# Altium project RSX_High_Power_Board.PrjPcb (part 1 of 2)
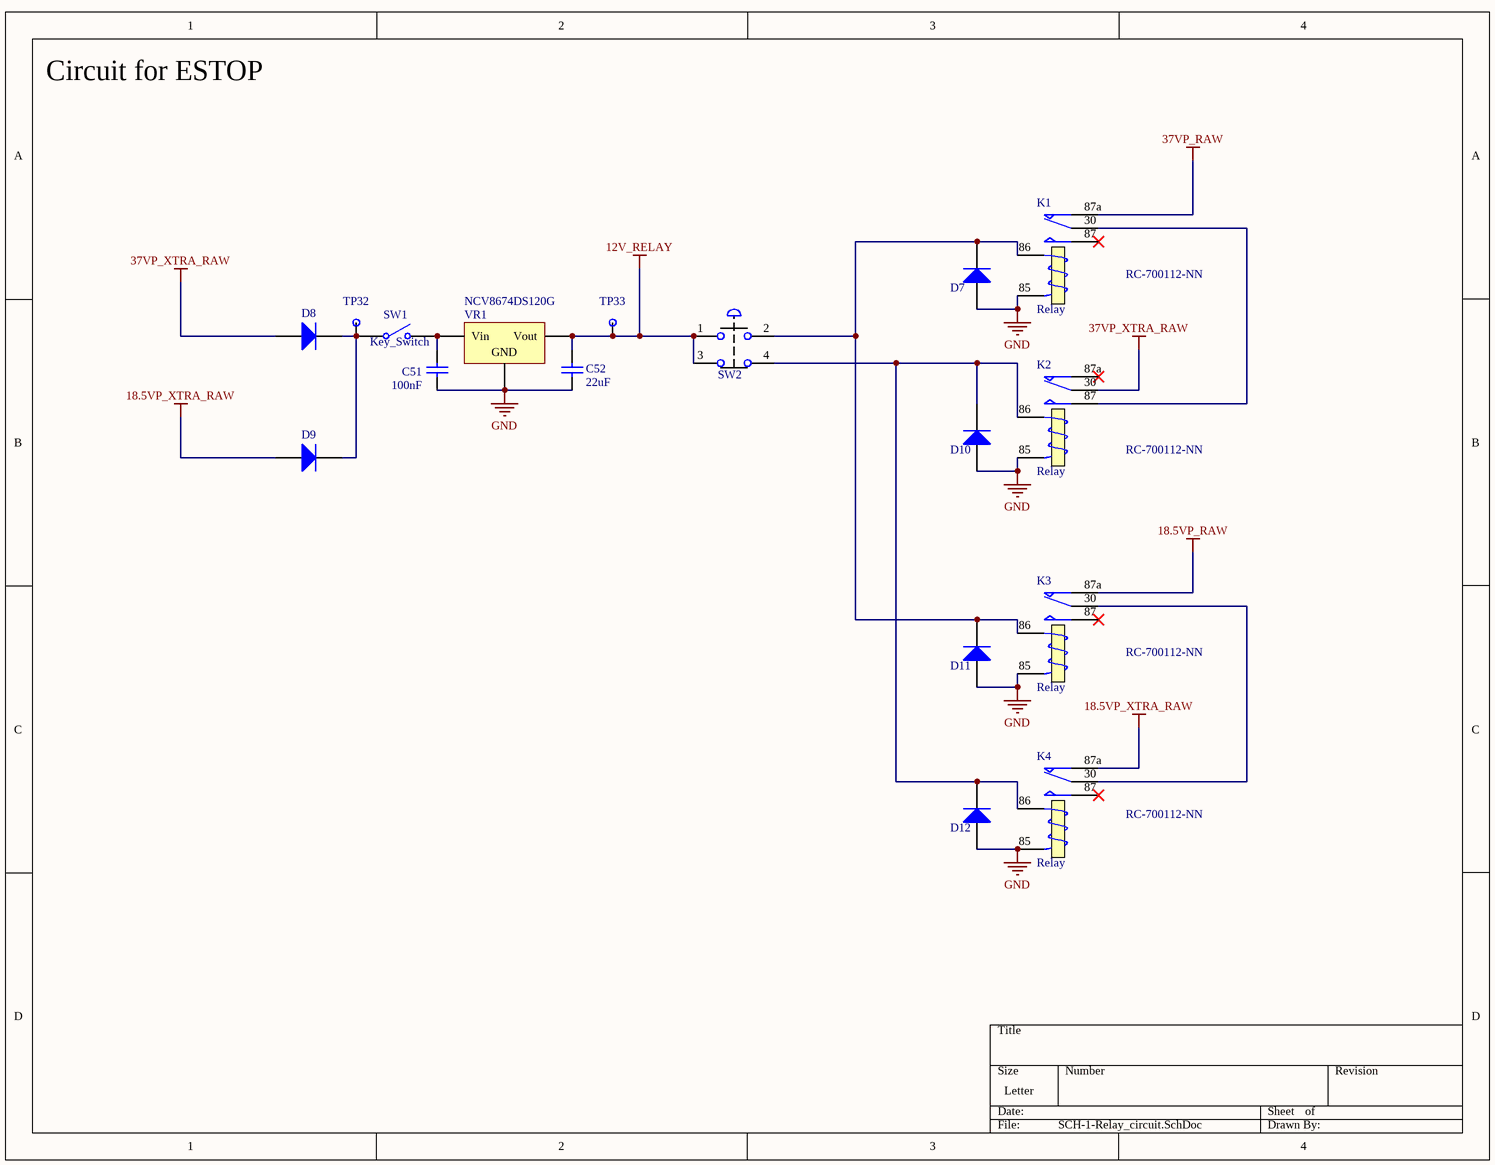
[diagram p0: SCH-1-Relay_circuit.SchDoc]
18 sheets, 301 parts. Net scope: flat (ports and power ports of the same name join across sheets).
Board file: High_Power_Board_v3.PcbDoc
Sheets:
  SCH-1-Relay_circuit.SchDoc
  SCH-2-Main Controls.SchDoc
  SCH-3-ESC1.SchDoc
  SCH-4-ESC2.SchDoc
  SCH-5-ESC3.SchDoc
  SCH-6-ESC4.SchDoc
  SCH-7-ESC5.SchDoc
  SCH-8-ESC6.SchDoc
  SCH-9-Battery Voltage Indicators.SchDoc
  SCH-10-Power Connectors.SchDoc
  SCH-11-Out Going Connectors.SchDoc
  3V3_board.SchDoc
  5V_board.SchDoc
  12V_board.SchDoc
  24V_board.SchDoc
  37V_efuse.SchDoc
  18V5_efuse.SchDoc
  Mounting_Holes.SchDoc

## Sheet SCH-1-Relay_circuit.SchDoc
size Letter

### Parts
C51  value 100nF  [1608[0603]]  (hidden comment: Cap)
C52  value 22uF  [1608[0603]]  (hidden comment: Cap)
D7  Diode 1N4001  [DO-41]  (value not drawn)
D8  Diode 1N4001  [DO-41]  (value not drawn)
D9  Diode 1N4001  [DO-41]  (value not drawn)
D10  Diode 1N4001  [DO-41]  (value not drawn)
D11  Diode 1N4001  [DO-41]  (value not drawn)
D12  Diode 1N4001  [DO-41]  (value not drawn)
K1  Relay  [Relay RC-700112-NN]
K2  Relay  [Relay RC-700112-NN]
K3  Relay  [Relay RC-700112-NN]
K4  Relay  [Relay RC-700112-NN]
SW1  Key_Switch  [MOLEX_0039293026]
SW2  NO-NC ESD with light  [MOLEX 0039281043]  (value not drawn)
TP32  TestPt  [50_MIL_PAD]  (value not drawn)
TP33  TestPt  [50_MIL_PAD]  (value not drawn)
VR1  Volt Reg  [DPAK254P1420X457-3N]  (value not drawn)

### Nets
12V_RELAY: C52.1 SW2.1 SW2.3 TP33.1 VR1.3(Vout)
18.5VP_RAW: K3.87a(NC)
18.5VP_XTRA_RAW: D9.1(A) K4.87a(NC)
37VP_RAW: K1.87a(NC)
37VP_XTRA_RAW: D8.1(A) K2.30(COM)
GND: C51.2 C52.2 D7.1(A) D10.1(A) D11.1(A) D12.1(A) K1.85(T2) K2.85(T2) K3.85(T2) K4.85(T2) VR1.2(GND)
NetC51_1: C51.1 SW1.2(NO) VR1.1(Vin)
NetD7_2: D7.2(K) D11.2(K) K1.86(T1) K3.86(T1) SW2.2
NetD8_2: D8.2(K) D9.2(K) SW1.1(COMMON) TP32.1
NetD10_2: D10.2(K) D12.2(K) K2.86(T1) K4.86(T1) SW2.4
NetK1_30: K1.30(COM) K2.87(NO)
NetK3_30: K3.30(COM) K4.30(COM)

Not connected (* = marked no-connect by the designer): K1 87(NO)*; K2 87a(NC)*; K3 87(NO)*; K4 87(NO)*

### Notes on the sheet
- Circuit for ESTOP
- (near VR1) NCV8674DS120G
- RC-700112-NN

### Library data of the parts
C51 C52 = Cap: Capacitor; Published: 8-Jun-2000; LatestRevisionDate: 17-Jul-2002; LatestRevisionNote: Re-released for DXP Platform.; PackageReference: RAD-0.3; Publisher: Altium Limited; PackageDescription: Radial Cap, Thru-Hole; 2 Leads; 0.3 in Pin Spacing
D7-D12 = Diode 1N4001: 1 Amp General Purpose Rectifier; Published: 8-Jun-2000; LatestRevisionDate: 17-Jul-2002; LatestRevisionNote: Re-released for DXP Platform.; DatasheetVersion: 1998; PackageVersion: Aug-1999; PackageReference: DO-41; Publisher: Altium Limited; PackageDescription: Diode, Axial; Body 5.2 x 2.7 mm (LxDia. max), Lead Dia. 0.86 mm (max); Code_JEDEC: DO-204-AL; ComponentLink1Description: Manufacturer Link; ComponentLink1URL: http://www.fairchildsemi.com/; ComponentLink2Description: Datasheet; ComponentLink2URL: http://www.fairchildsemi.com/ds/1N%2F1N4001.pdf
K1-K4 = Relay: SPDT Relay; Published: 8-Jun-2000; LatestRevisionDate: 17-Jul-2002; LatestRevisionNote: Re-released for DXP Platform.; PackageReference: MODULE5B; Publisher: Altium Limited
SW2 = DPST ESTOP
VR1 = Volt Reg: Voltage Regulator; Published: 24-Mar-1999; LatestRevisionDate: 29-May-2009; LatestRevisionNote: IPC-7351 Footprint Added.; PackageReference: D2PAK; Publisher: Altium Limited; PackageDescription: 3-Pin Transistor Outline Package 2.54 mm Pitch, 15.1 mm Lead Span
SW1 = Key_Switch: Published: 24-Mar-1999; LatestRevisionDate: 17-Jul-2002; LatestRevisionNote: Re-released for DXP Platform.; PackageReference: SPST-2; Publisher: Altium Limited; PackageDescription: Switch; 2 Leads

## Sheet SCH-2-Main Controls.SchDoc
size Letter
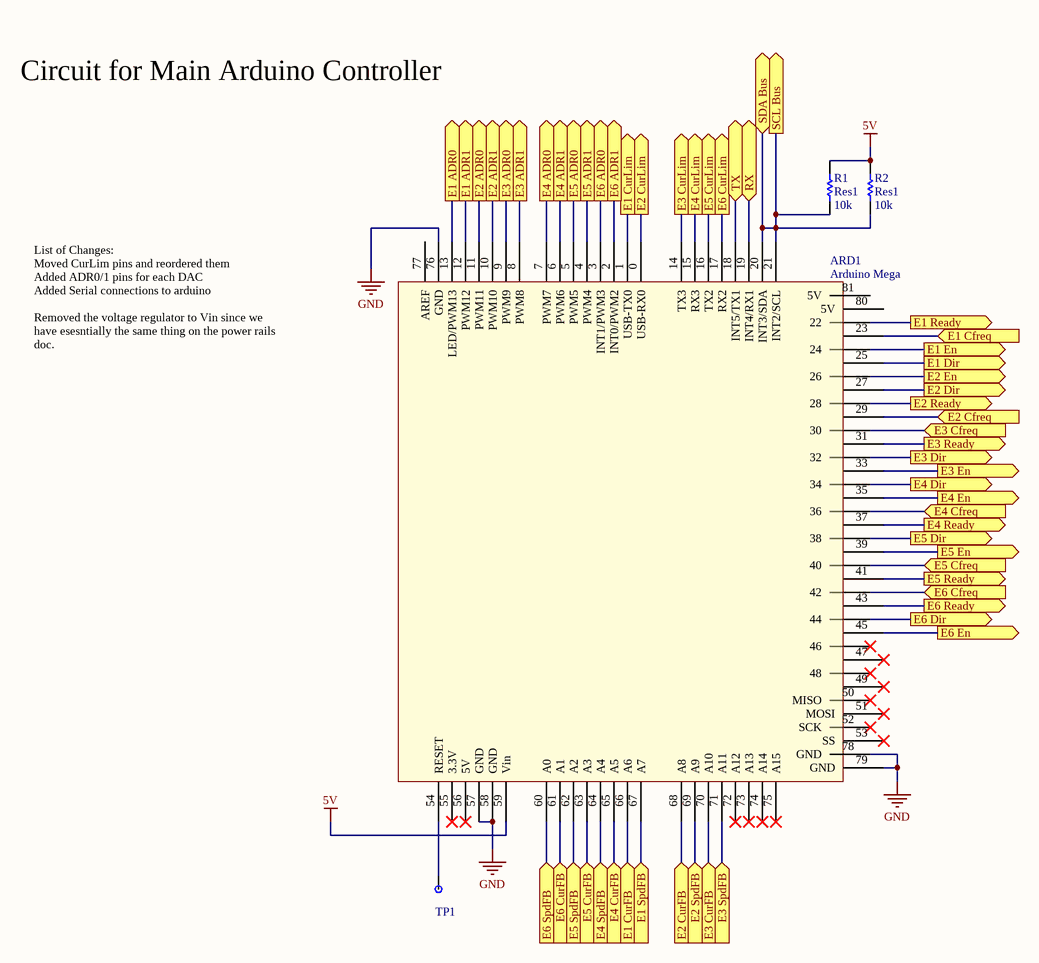
[diagram p1: SCH-2-Main Controls.SchDoc]

### Parts
ARD1  Arduino Mega  [Arduino Mega]
R1  Res1  value 10k  [RESC1608X06N_0603]
R2  Res1  value 10k  [RESC1608X06N_0603]
TP1  TestPt  [50_MIL_PAD]  (value not drawn)

### Ports
E1 ADR0 (out), E1 ADR1 (out), E1 Cfreq (in), E1 CurFB (in), E1 CurLim (out), E1 Dir (out), E1 En (out), E1 Ready (out), E1 SpdFB (in), E2 ADR0 (out), E2 ADR1 (out), E2 Cfreq (in), E2 CurFB (in), E2 CurLim (out), E2 Dir (out), E2 En (out), E2 Ready (out), E2 SpdFB (in), E3 ADR0 (out), E3 ADR1 (out), E3 Cfreq (in), E3 CurFB (in), E3 CurLim (out), E3 Dir (out), E3 En (out), E3 Ready (out), E3 SpdFB (in), E4 ADR0 (out), E4 ADR1 (out), E4 Cfreq (in), E4 CurFB (in), E4 CurLim (out), E4 Dir (out), E4 En (out), E4 Ready (out), E4 SpdFB (in), E5 ADR0 (out), E5 ADR1 (out), E5 Cfreq (in), E5 CurFB (in), E5 CurLim (out), E5 Dir (out), E5 En (out), E5 Ready (out), E5 SpdFB (in), E6 ADR0 (out), E6 ADR1 (out), E6 Cfreq (in), E6 CurFB (in), E6 CurLim (out), E6 Dir (out), E6 En (out), E6 Ready (out), E6 SpdFB (in), RX (bidir), SCL Bus (out), SDA Bus (bidir), TX (bidir)

### Nets
5V: ARD1.59(Vin) R1.2 R2.2
GND: ARD1.57(GND) ARD1.58(GND) ARD1.76(GND) ARD1.78(GND) ARD1.79(GND)
NetARD1_0: ARD1.0(USB-RX0) ; port E2 CurLim
NetARD1_1: ARD1.1(USB-TX0) ; port E1 CurLim
NetARD1_2: ARD1.2(INT0/PWM2) ; port E6 ADR1
NetARD1_3: ARD1.3(INT1/PWM3) ; port E6 ADR0
NetARD1_4: ARD1.4(PWM4) ; port E5 ADR1
NetARD1_5: ARD1.5(PWM5) ; port E5 ADR0
NetARD1_6: ARD1.6(PWM6) ; port E4 ADR1
NetARD1_7: ARD1.7(PWM7) ; port E4 ADR0
NetARD1_8: ARD1.8(PWM8) ; port E3 ADR1
NetARD1_9: ARD1.9(PWM9) ; port E3 ADR0
NetARD1_10: ARD1.10(PWM10) ; port E2 ADR1
NetARD1_11: ARD1.11(PWM11) ; port E2 ADR0
NetARD1_12: ARD1.12(PWM12) ; port E1 ADR1
NetARD1_13: ARD1.13(LED/PWM13) ; port E1 ADR0
NetARD1_14: ARD1.14(TX3) ; port E3 CurLim
NetARD1_15: ARD1.15(RX3) ; port E4 CurLim
NetARD1_16: ARD1.16(TX2) ; port E5 CurLim
NetARD1_17: ARD1.17(RX2) ; port E6 CurLim
NetARD1_18: ARD1.18(INT5/TX1) ; port TX
NetARD1_19: ARD1.19(INT4/RX1) ; port RX
NetARD1_20: ARD1.20(INT3/SDA) ARD1.21(INT2/SCL) R1.1 R2.1 ; port SCL Bus, port SDA Bus
NetARD1_22: ARD1.22 ; port E1 Ready
NetARD1_23: ARD1.23 ; port E1 Cfreq
NetARD1_24: ARD1.24 ; port E1 En
NetARD1_25: ARD1.25 ; port E1 Dir
NetARD1_26: ARD1.26 ; port E2 En
NetARD1_27: ARD1.27 ; port E2 Dir
NetARD1_28: ARD1.28 ; port E2 Ready
NetARD1_29: ARD1.29 ; port E2 Cfreq
NetARD1_30: ARD1.30 ; port E3 Cfreq
NetARD1_31: ARD1.31 ; port E3 Ready
NetARD1_32: ARD1.32 ; port E3 Dir
NetARD1_33: ARD1.33 ; port E3 En
NetARD1_34: ARD1.34 ; port E4 Dir
NetARD1_35: ARD1.35 ; port E4 En
NetARD1_36: ARD1.36 ; port E4 Cfreq
NetARD1_37: ARD1.37 ; port E4 Ready
NetARD1_38: ARD1.38 ; port E5 Dir
NetARD1_39: ARD1.39 ; port E5 En
NetARD1_40: ARD1.40 ; port E5 Cfreq
NetARD1_41: ARD1.41 ; port E5 Ready
NetARD1_42: ARD1.42 ; port E6 Cfreq
NetARD1_43: ARD1.43 ; port E6 Ready
NetARD1_44: ARD1.44 ; port E6 Dir
NetARD1_45: ARD1.45 ; port E6 En
NetARD1_54: ARD1.54(RESET) TP1.1
NetARD1_60: ARD1.60(A0) ; port E6 SpdFB
NetARD1_61: ARD1.61(A1) ; port E6 CurFB
NetARD1_62: ARD1.62(A2) ; port E5 SpdFB
NetARD1_63: ARD1.63(A3) ; port E5 CurFB
NetARD1_64: ARD1.64(A4) ; port E4 SpdFB
NetARD1_65: ARD1.65(A5) ; port E4 CurFB
NetARD1_66: ARD1.66(A6) ; port E1 CurFB
NetARD1_67: ARD1.67(A7) ; port E1 SpdFB
NetARD1_68: ARD1.68(A8) ; port E2 CurFB
NetARD1_69: ARD1.69(A9) ; port E2 SpdFB
NetARD1_70: ARD1.70(A10) ; port E3 CurFB
NetARD1_71: ARD1.71(A11) ; port E3 SpdFB

Not connected (* = marked no-connect by the designer): ARD1 46* 47* 48* 49* 50(MISO)* 51(MOSI)* 52(SCK)* 53(SS)* 55(3.3V)* 56(5V)* 72(A12)* 73(A13)* 74(A14)* 75(A15)* 77(AREF) 80(5V) 81(5V)

### Notes on the sheet
- Circuit for Main Arduino Controller
- List of Changes:
  Moved CurLim pins and reordered them
  Added ADR0/1 pins for each DAC
  Added Serial connections to arduino
  Removed the voltage regulator to Vin since we have esesntially the same thing on the power rails doc.

### Library data of the parts
R1 R2 = Res1: Resistor; Published: 8-Jun-2000; LatestRevisionDate: 17-Jul-2002; LatestRevisionNote: Re-released for DXP Platform.; PackageReference: AXIAL-0.3; Publisher: Altium Limited; PackageDescription: Axial Device, Thru-Hole; 2 Leads; 0.3 in Pin Spacing

## Sheet SCH-3-ESC1.SchDoc
size Letter; SheetNumber: 2
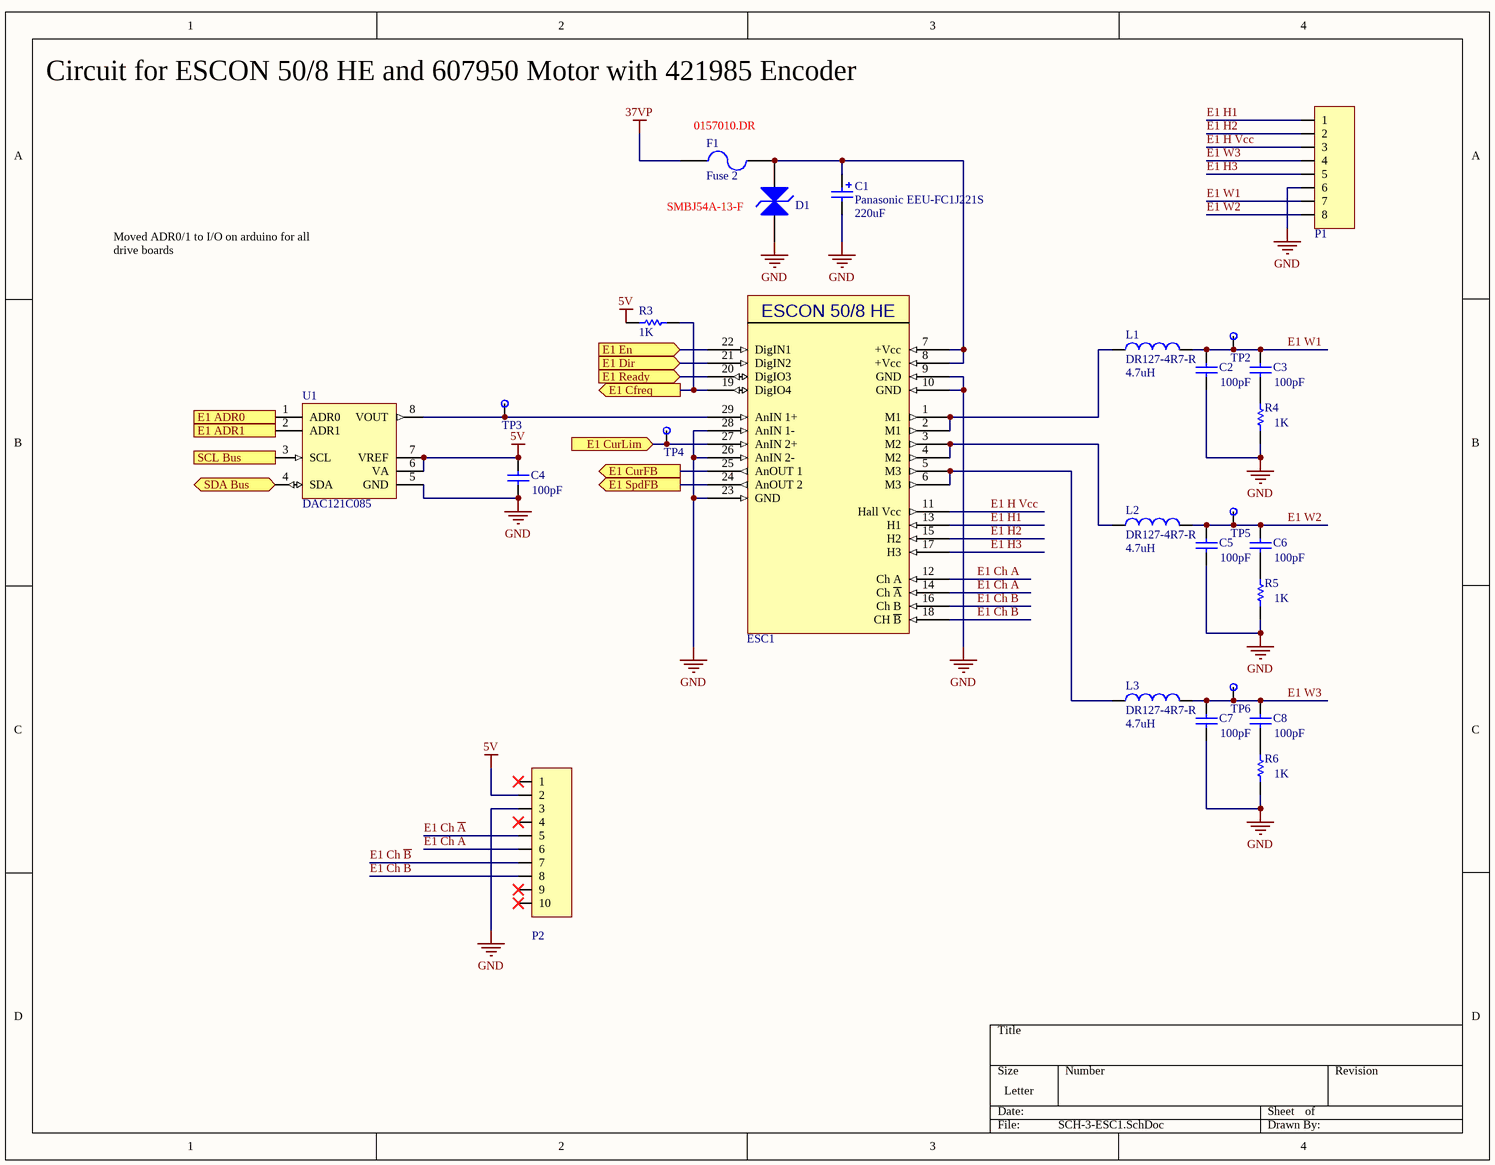
[diagram p2: SCH-3-ESC1.SchDoc]

### Parts
C1  Panasonic EEU-FC1J221S  value 220uF  [Panasonic EEU-FC1J221S]
C2  value 100pF  [C1206]  (hidden comment: Cap Semi)
C3  value 100pF  [C1206]  (hidden comment: Cap Semi)
C4  value 100pF  [C1206]  (hidden comment: Cap Semi)
C5  value 100pF  [C1206]  (hidden comment: Cap Semi)
C6  value 100pF  [C1206]  (hidden comment: Cap Semi)
C7  value 100pF  [C1206]  (hidden comment: Cap Semi)
C8  value 100pF  [C1206]  (hidden comment: Cap Semi)
D1  TVS_DIODE  [SMBJ54A-13-F]  (value not drawn)
ESC1  ESCON 50/8 HE  [ESCON 50/8 HE]  (value not drawn)
F1  Fuse 2  [0157010.DR]
L1  DR127-4R7-R  value 4.7uH  [DR127-4R7-R]
L2  DR127-4R7-R  value 4.7uH  [DR127-4R7-R]
L3  DR127-4R7-R  value 4.7uH  [DR127-4R7-R]
P1  0039281083  [Molex Mini-Fit Jr 0039281083]  (value not drawn)
P2  Header_10_Pos_Ribbon Male  [3M_2510-6002UB]  (value not drawn)
R3  value 1K  [RESC1608X06N_0603]  (hidden comment: Res1)
R4  value 1K  [RESC1608X06N_0603]  (hidden comment: Res1)
R5  value 1K  [RESC1608X06N_0603]  (hidden comment: Res1)
R6  value 1K  [RESC1608X06N_0603]  (hidden comment: Res1)
TP2  TestPt  [50_MIL_PAD]  (value not drawn)
TP3  TestPt  [50_MIL_PAD]  (value not drawn)
TP4  TestPt  [50_MIL_PAD]  (value not drawn)
TP5  TestPt  [50_MIL_PAD]  (value not drawn)
TP6  TestPt  [50_MIL_PAD]  (value not drawn)
U1  DAC121C085  [MUA08A_L]

### Ports
E1 ADR0 (in), E1 ADR1 (in), E1 Cfreq (out), E1 CurFB (out), E1 CurLim (in), E1 Dir (in), E1 En (in), E1 Ready (in), E1 SpdFB (out), SCL Bus (in), SDA Bus (bidir)

### Nets
5V: C4.2 P2.2 R3.2 U1.6(VA) U1.7(VREF)
37VP: F1.1
GND: C1.2 C2.1 C4.1 C5.1 C7.1 D1.1(A) ESC1.9(GND) ESC1.10(GND) ESC1.23(GND) ESC1.26(AnIN_2-) ESC1.28(AnIN_1-) P1.6 P2.3 R4.1 R5.1 R6.1 U1.5(GND)
E1 Ch A: ESC1.12(Ch_A) P2.6
E1 Ch ~{A}: ESC1.14(Ch_~{A}) P2.5
E1 Ch B: ESC1.16(Ch_B) P2.8
E1 Ch ~{B}: ESC1.18(CH_~{B}) P2.7
E1 H1: ESC1.13(H1) P1.1
E1 H2: ESC1.15(H2) P1.2
E1 H3: ESC1.17(H3) P1.5
E1 H Vcc: ESC1.11(Hall_Vcc) P1.3
E1 W1: C2.2 C3.2 L1.2 P1.7 TP2.1
E1 W2: C5.2 C6.2 L2.2 P1.8 TP5.1
E1 W3: C7.2 C8.2 L3.2 P1.4 TP6.1
NetARD1_1: ESC1.27(AnIN_2+) TP4.1 ; port E1 CurLim
NetARD1_12: U1.2(ADR1) ; port E1 ADR1
NetARD1_13: U1.1(ADR0) ; port E1 ADR0
NetARD1_20: U1.3(SCL) U1.4(SDA) ; port SCL Bus, port SDA Bus
NetARD1_22: ESC1.20(DigIO3) ; port E1 Ready
NetARD1_23: ESC1.19(DigIO4) R3.1 ; port E1 Cfreq
NetARD1_24: ESC1.22(DigIN1) ; port E1 En
NetARD1_25: ESC1.21(DigIN2) ; port E1 Dir
NetARD1_66: ESC1.25(AnOUT_1) ; port E1 CurFB
NetARD1_67: ESC1.24(AnOUT_2) ; port E1 SpdFB
NetC1_1: C1.1 D1.2(K) ESC1.7(+Vcc) ESC1.8(+Vcc) F1.2
NetC3_1: C3.1 R4.2
NetC6_1: C6.1 R5.2
NetC8_1: C8.1 R6.2
NetESC1_1: ESC1.1(M1) ESC1.2(M1) L1.1
NetESC1_3: ESC1.3(M2) ESC1.4(M2) L2.1
NetESC1_5: ESC1.5(M3) ESC1.6(M3) L3.1
NetESC1_29: ESC1.29(AnIN_1+) TP3.1 U1.8(VOUT)

Not connected (* = marked no-connect by the designer): P2 1* 4* 9* 10*

### Notes on the sheet
- Circuit for ESCON 50/8 HE and 607950 Motor with 421985 Encoder
- (near F1) 0157010.DR
- SMBJ54A-13-F
- Moved ADR0/1 to I/O on arduino for all drive boards

### Library data of the parts
C1 = Panasonic EEU-FC1J221S: Polarized Capacitor (Radial)
C2-C8 = Cap Semi: Capacitor (Semiconductor SIM Model); Published: 8-Jun-2000; LatestRevisionDate: 29-May-2009; LatestRevisionNote: IPC-7351 Footprint Added.; PackageReference: C1206; Publisher: Altium Limited; PackageDescription: Chip Capacitor
D1 = TVS_DIODE: TVS Diode; Published: 8-Jun-2000; LatestRevisionDate: 17-Jul-2002; LatestRevisionNote: Re-released for DXP Platform.; PackageVersion: Sep-1996; PackageReference: SMC; Publisher: Altium Limited; PackageDescription: DO-214-AB/SMC; 2 C-Bend Leads; Body 7.9 x 5.9 mm, inc. leads (LxW); Code_JEDEC: DO-214-AB
ESC1 = ESCON 50/8 HE: ESCON Module 50/8 HE Servocontroller
F1 = Fuse 2: Fuse; Published: 8-Jun-2000; LatestRevisionDate: 17-Jul-2002; LatestRevisionNote: Re-released for DXP Platform.; PackageReference: PIN-W2/E2.8; Publisher: Altium Limited; PackageDescription: Thru-Hole; 2 Leads
L1-L3 = DR127-4R7-R: 4.7µH Shielded Wirewound Inductor 8.25A 9.17mOhm Nonstandard; Code_IEC: 1005; Published: 8-Jun-2000; LatestRevisionDate: 29-May-2009; LatestRevisionNote: IPC-7351 Footprint Added.; PackageReference: 0402-A; Publisher: Altium Limited; PackageDescription: Chip Inductor; Code_JEITA: 0402
P1 = Molex Mini-Fit Jr 8pos Vert: Mini-Fit Jr, 8 pos 2 row
P2 = Header_10_Pos_Ribbon Male: IDC, 10 pos, Male
R3-R6 = Res1: Resistor; Published: 8-Jun-2000; LatestRevisionDate: 17-Jul-2002; LatestRevisionNote: Re-released for DXP Platform.; PackageReference: AXIAL-0.3; Publisher: Altium Limited; PackageDescription: Axial Device, Thru-Hole; 2 Leads; 0.3 in Pin Spacing
U1 = DAC121C085: 12-Bit Micro Power Digital-to-Analog Converter with an I2C-Compatible Interface and External Reference, 8-pin Mini SOIC, Pb-Free; Manufacturer: National Semiconductor; PackageTopMarking: XTT*X90C; PowerWise: Y; CompType: D/A Converter; ComponentLink3URL: http://www.national.com/packaging/folders/mua08a.html; ComponentLink2URL: http://www.national.com/pf/DA/DAC121C085.html; Code_JEDEC: MO-187-AA; ComponentLink1URL: http://www.national.com/ds/DA/DAC121C085.pdf; RoHS: Y; PackageVersion: revF, Apr-2008; PackageDescription: MINI SOIC, .118 x .118 x .034in, 8 Lead, .0256in Pitch; PackageReference: MUA08A; PinCount: 8; DatasheetVersion: Mar-2008; ComponentLink1Description: DAC121C085 Datasheet; ComponentLink2Description: DAC121C085 Web Page; ComponentLink3Description: MUA08A Package Page; RevisionNote: Component URLs added

## Sheet SCH-4-ESC2.SchDoc
size Letter; SheetNumber: 2
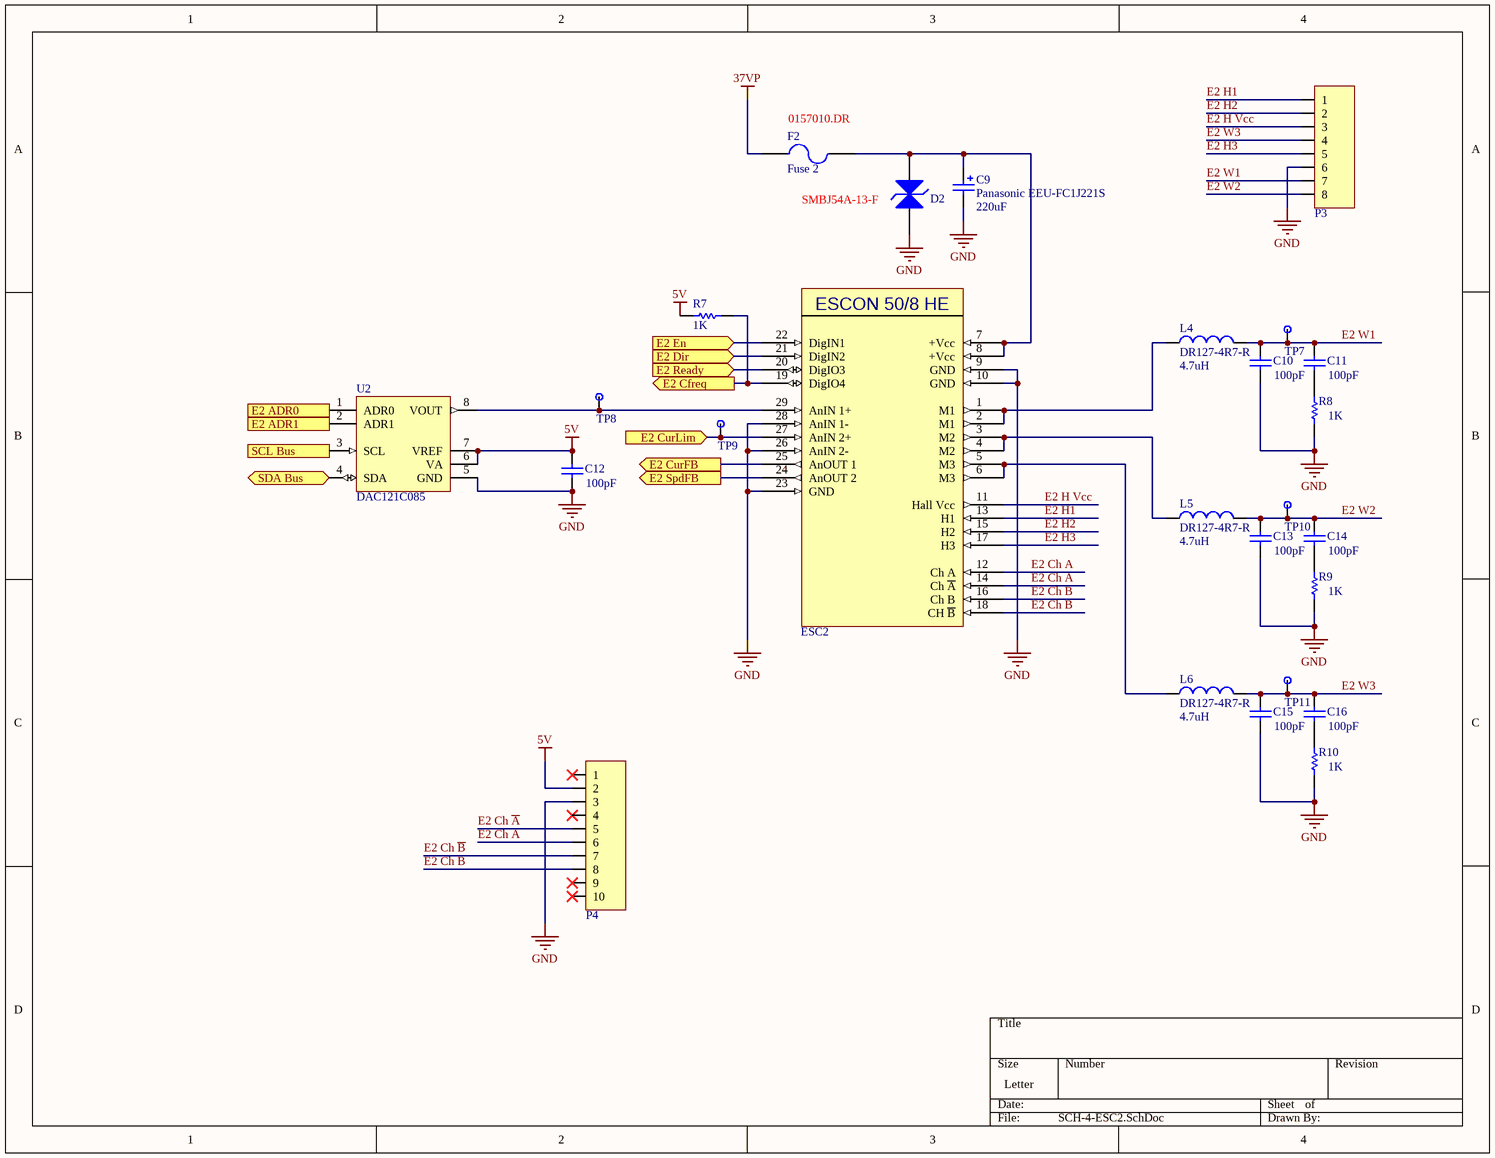
[diagram p3: SCH-4-ESC2.SchDoc]

### Parts
C9  Panasonic EEU-FC1J221S  value 220uF  [Panasonic EEU-FC1J221S]
C10  value 100pF  [C1206]  (hidden comment: Cap Semi)
C11  value 100pF  [C1206]  (hidden comment: Cap Semi)
C12  value 100pF  [C1206]  (hidden comment: Cap Semi)
C13  value 100pF  [C1206]  (hidden comment: Cap Semi)
C14  value 100pF  [C1206]  (hidden comment: Cap Semi)
C15  value 100pF  [C1206]  (hidden comment: Cap Semi)
C16  value 100pF  [C1206]  (hidden comment: Cap Semi)
D2  TVS_DIODE  [SMBJ54A-13-F]  (value not drawn)
ESC2  ESCON 50/8 HE  [ESCON 50/8 HE]  (value not drawn)
F2  Fuse 2  [0157010.DR]
L4  DR127-4R7-R  value 4.7uH  [DR127-4R7-R]
L5  DR127-4R7-R  value 4.7uH  [DR127-4R7-R]
L6  DR127-4R7-R  value 4.7uH  [DR127-4R7-R]
P3  0039281083  [Molex Mini-Fit Jr 0039281083]  (value not drawn)
P4  Header_10_Pos_Ribbon Male  [3M_2510-6002UB]  (value not drawn)
R7  value 1K  [RESC1608X06N_0603]  (hidden comment: Res1)
R8  value 1K  [RESC1608X06N_0603]  (hidden comment: Res1)
R9  value 1K  [RESC1608X06N_0603]  (hidden comment: Res1)
R10  value 1K  [RESC1608X06N_0603]  (hidden comment: Res1)
TP7  TestPt  [50_MIL_PAD]  (value not drawn)
TP8  TestPt  [50_MIL_PAD]  (value not drawn)
TP9  TestPt  [50_MIL_PAD]  (value not drawn)
TP10  TestPt  [50_MIL_PAD]  (value not drawn)
TP11  TestPt  [50_MIL_PAD]  (value not drawn)
U2  DAC121C085  [MUA08A_L]

### Ports
E2 ADR0 (in), E2 ADR1 (in), E2 Cfreq (out), E2 CurFB (out), E2 CurLim (in), E2 Dir (in), E2 En (in), E2 Ready (in), E2 SpdFB (out), SCL Bus (in), SDA Bus (bidir)

### Nets
5V: C12.2 P4.2 R7.2 U2.6(VA) U2.7(VREF)
37VP: F2.1
GND: C9.2 C10.1 C12.1 C13.1 C15.1 D2.1(A) ESC2.9(GND) ESC2.10(GND) ESC2.23(GND) ESC2.26(AnIN_2-) ESC2.28(AnIN_1-) P3.6 P4.3 R8.1 R9.1 R10.1 U2.5(GND)
E2 Ch A: ESC2.12(Ch_A) P4.6
E2 Ch ~{A}: ESC2.14(Ch_~{A}) P4.5
E2 Ch B: ESC2.16(Ch_B) P4.8
E2 Ch ~{B}: ESC2.18(CH_~{B}) P4.7
E2 H1: ESC2.13(H1) P3.1
E2 H2: ESC2.15(H2) P3.2
E2 H3: ESC2.17(H3) P3.5
E2 H Vcc: ESC2.11(Hall_Vcc) P3.3
E2 W1: C10.2 C11.2 L4.2 P3.7 TP7.1
E2 W2: C13.2 C14.2 L5.2 P3.8 TP10.1
E2 W3: C15.2 C16.2 L6.2 P3.4 TP11.1
NetARD1_0: ESC2.27(AnIN_2+) TP9.1 ; port E2 CurLim
NetARD1_10: U2.2(ADR1) ; port E2 ADR1
NetARD1_11: U2.1(ADR0) ; port E2 ADR0
NetARD1_20: U2.3(SCL) U2.4(SDA) ; port SCL Bus, port SDA Bus
NetARD1_26: ESC2.22(DigIN1) ; port E2 En
NetARD1_27: ESC2.21(DigIN2) ; port E2 Dir
NetARD1_28: ESC2.20(DigIO3) ; port E2 Ready
NetARD1_29: ESC2.19(DigIO4) R7.1 ; port E2 Cfreq
NetARD1_68: ESC2.25(AnOUT_1) ; port E2 CurFB
NetARD1_69: ESC2.24(AnOUT_2) ; port E2 SpdFB
NetC9_1: C9.1 D2.2(K) ESC2.7(+Vcc) ESC2.8(+Vcc) F2.2
NetC11_1: C11.1 R8.2
NetC14_1: C14.1 R9.2
NetC16_1: C16.1 R10.2
NetESC2_1: ESC2.1(M1) ESC2.2(M1) L4.1
NetESC2_3: ESC2.3(M2) ESC2.4(M2) L5.1
NetESC2_5: ESC2.5(M3) ESC2.6(M3) L6.1
NetESC2_29: ESC2.29(AnIN_1+) TP8.1 U2.8(VOUT)

Not connected (* = marked no-connect by the designer): P4 1* 4* 9* 10*

### Notes on the sheet
- (near F2) 0157010.DR
- SMBJ54A-13-F

### Library data of the parts
C9 = Panasonic EEU-FC1J221S: Polarized Capacitor (Radial)
C10-C16 = Cap Semi: Capacitor (Semiconductor SIM Model); Published: 8-Jun-2000; LatestRevisionDate: 29-May-2009; LatestRevisionNote: IPC-7351 Footprint Added.; PackageReference: C1206; Publisher: Altium Limited; PackageDescription: Chip Capacitor
D2 = TVS_DIODE: TVS Diode; Published: 8-Jun-2000; LatestRevisionDate: 17-Jul-2002; LatestRevisionNote: Re-released for DXP Platform.; PackageVersion: Sep-1996; PackageReference: SMC; Publisher: Altium Limited; PackageDescription: DO-214-AB/SMC; 2 C-Bend Leads; Body 7.9 x 5.9 mm, inc. leads (LxW); Code_JEDEC: DO-214-AB
ESC2 = ESCON 50/8 HE: ESCON Module 50/8 HE Servocontroller
F2 = Fuse 2: Fuse; Published: 8-Jun-2000; LatestRevisionDate: 17-Jul-2002; LatestRevisionNote: Re-released for DXP Platform.; PackageReference: PIN-W2/E2.8; Publisher: Altium Limited; PackageDescription: Thru-Hole; 2 Leads
L4-L6 = DR127-4R7-R: as L1 on sheet SCH-3-ESC1; Published: 8-Jun-2000; LatestRevisionDate: 29-May-2009; LatestRevisionNote: IPC-7351 Footprint Added.; PackageReference: 0402-A; Publisher: Altium Limited; PackageDescription: Chip Inductor; Code_JEITA: 0402
P3 = Molex Mini-Fit Jr 8pos Vert: Mini-Fit Jr, 8 pos 2 row
P4 = Header_10_Pos_Ribbon Male: IDC, 10 pos, Male
R7-R10 = Res1: Resistor; Published: 8-Jun-2000; LatestRevisionDate: 17-Jul-2002; LatestRevisionNote: Re-released for DXP Platform.; PackageReference: AXIAL-0.3; Publisher: Altium Limited; PackageDescription: Axial Device, Thru-Hole; 2 Leads; 0.3 in Pin Spacing
U2 = DAC121C085: as U1 on sheet SCH-3-ESC1; ComponentLink3URL: http://www.national.com/packaging/folders/mua08a.html; ComponentLink2URL: http://www.national.com/pf/DA/DAC121C085.html; Code_JEDEC: MO-187-AA; ComponentLink1URL: http://www.national.com/ds/DA/DAC121C085.pdf; RoHS: Y; PackageVersion: revF, Apr-2008; PackageDescription: MINI SOIC, .118 x .118 x .034in, 8 Lead, .0256in Pitch; PackageReference: MUA08A; PinCount: 8; DatasheetVersion: Mar-2008; ComponentLink1Description: DAC121C085 Datasheet; ComponentLink2Description: DAC121C085 Web Page; ComponentLink3Description: MUA08A Package Page; RevisionNote: Component URLs added

## Sheet SCH-5-ESC3.SchDoc
size Letter
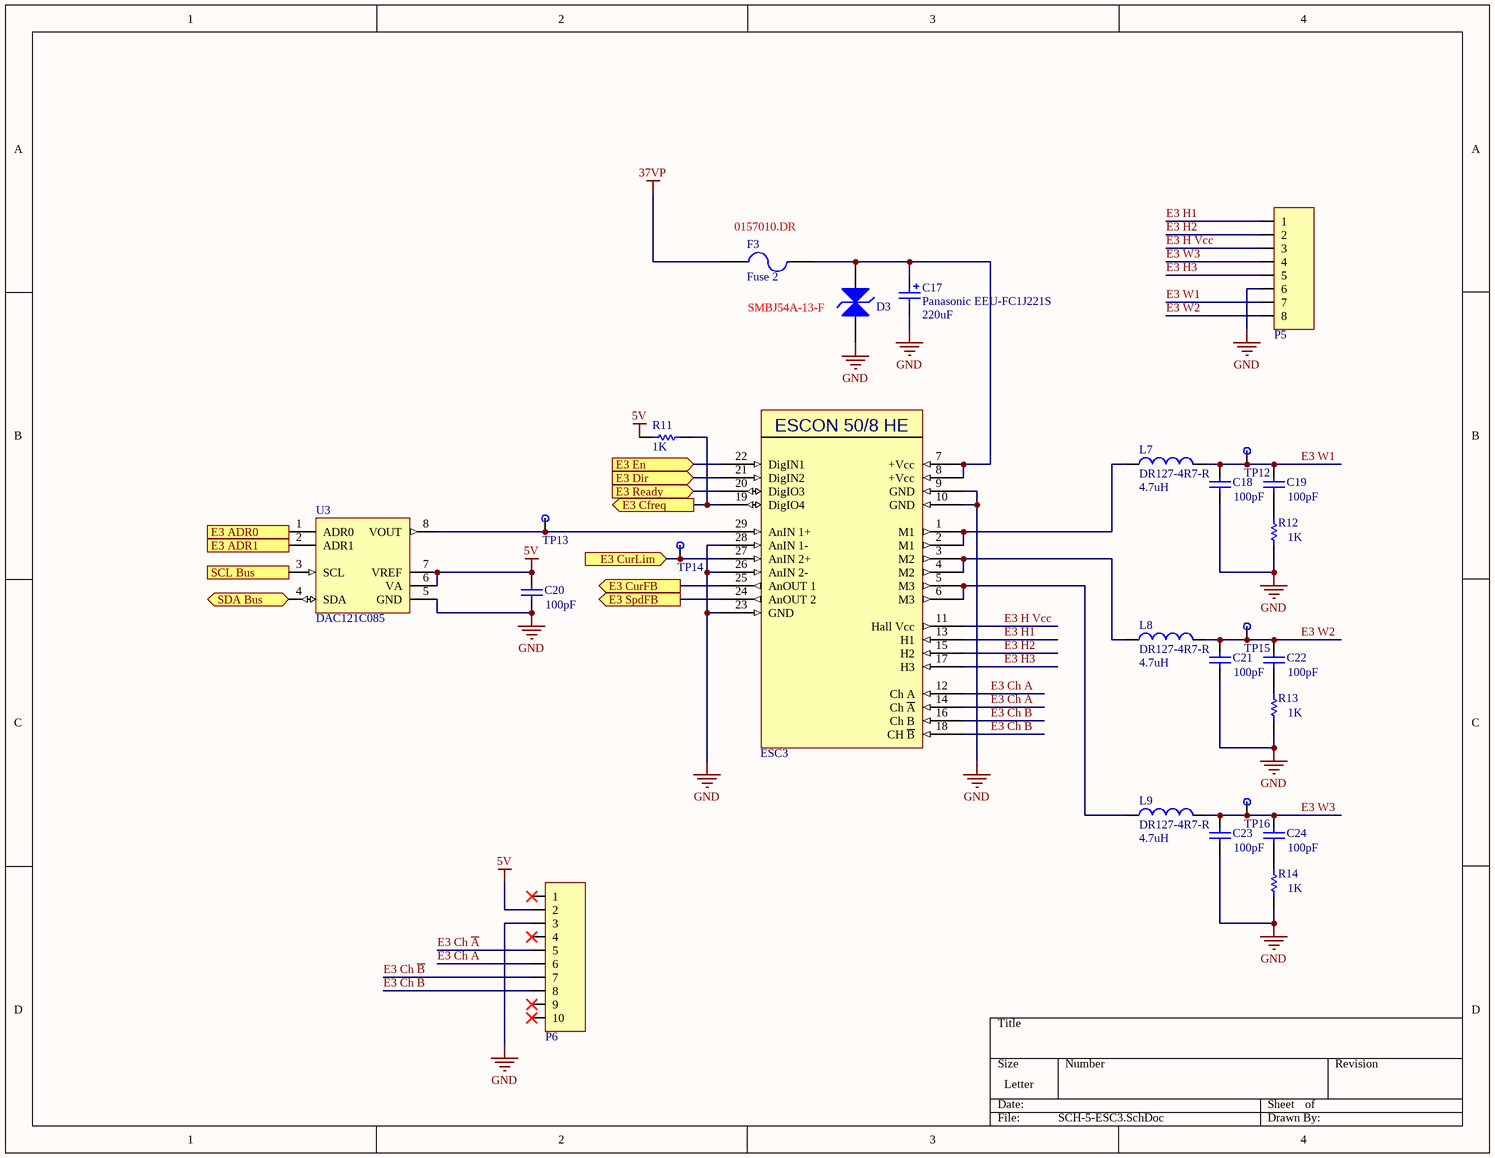
[diagram p4: SCH-5-ESC3.SchDoc]

### Parts
C17  Panasonic EEU-FC1J221S  value 220uF  [Panasonic EEU-FC1J221S]
C18  value 100pF  [C1206]  (hidden comment: Cap Semi)
C19  value 100pF  [C1206]  (hidden comment: Cap Semi)
C20  value 100pF  [C1206]  (hidden comment: Cap Semi)
C21  value 100pF  [C1206]  (hidden comment: Cap Semi)
C22  value 100pF  [C1206]  (hidden comment: Cap Semi)
C23  value 100pF  [C1206]  (hidden comment: Cap Semi)
C24  value 100pF  [C1206]  (hidden comment: Cap Semi)
D3  TVS_DIODE  [SMBJ54A-13-F]  (value not drawn)
ESC3  ESCON 50/8 HE  [ESCON 50/8 HE]  (value not drawn)
F3  Fuse 2  [0157010.DR]
L7  DR127-4R7-R  value 4.7uH  [DR127-4R7-R]
L8  DR127-4R7-R  value 4.7uH  [DR127-4R7-R]
L9  DR127-4R7-R  value 4.7uH  [DR127-4R7-R]
P5  0039281083  [Molex Mini-Fit Jr 0039281083]  (value not drawn)
P6  Header_10_Pos_Ribbon Male  [3M_2510-6002UB]  (value not drawn)
R11  value 1K  [RESC1608X06N_0603]  (hidden comment: Res1)
R12  value 1K  [RESC1608X06N_0603]  (hidden comment: Res1)
R13  value 1K  [RESC1608X06N_0603]  (hidden comment: Res1)
R14  value 1K  [RESC1608X06N_0603]  (hidden comment: Res1)
TP12  TestPt  [50_MIL_PAD]  (value not drawn)
TP13  TestPt  [50_MIL_PAD]  (value not drawn)
TP14  TestPt  [50_MIL_PAD]  (value not drawn)
TP15  TestPt  [50_MIL_PAD]  (value not drawn)
TP16  TestPt  [50_MIL_PAD]  (value not drawn)
U3  DAC121C085  [MUA08A_L]

### Ports
E3 ADR0 (in), E3 ADR1 (in), E3 Cfreq (out), E3 CurFB (out), E3 CurLim (in), E3 Dir (in), E3 En (in), E3 Ready (in), E3 SpdFB (out), SCL Bus (in), SDA Bus (bidir)

### Nets
5V: C20.2 P6.2 R11.2 U3.6(VA) U3.7(VREF)
37VP: F3.1
GND: C17.2 C18.1 C20.1 C21.1 C23.1 D3.1(A) ESC3.9(GND) ESC3.10(GND) ESC3.23(GND) ESC3.26(AnIN_2-) ESC3.28(AnIN_1-) P5.6 P6.3 R12.1 R13.1 R14.1 U3.5(GND)
E3 Ch A: ESC3.12(Ch_A) P6.6
E3 Ch ~{A}: ESC3.14(Ch_~{A}) P6.5
E3 Ch B: ESC3.16(Ch_B) P6.8
E3 Ch ~{B}: ESC3.18(CH_~{B}) P6.7
E3 H1: ESC3.13(H1) P5.1
E3 H2: ESC3.15(H2) P5.2
E3 H3: ESC3.17(H3) P5.5
E3 H Vcc: ESC3.11(Hall_Vcc) P5.3
E3 W1: C18.2 C19.2 L7.2 P5.7 TP12.1
E3 W2: C21.2 C22.2 L8.2 P5.8 TP15.1
E3 W3: C23.2 C24.2 L9.2 P5.4 TP16.1
NetARD1_8: U3.2(ADR1) ; port E3 ADR1
NetARD1_9: U3.1(ADR0) ; port E3 ADR0
NetARD1_14: ESC3.27(AnIN_2+) TP14.1 ; port E3 CurLim
NetARD1_20: U3.3(SCL) U3.4(SDA) ; port SCL Bus, port SDA Bus
NetARD1_30: ESC3.19(DigIO4) R11.1 ; port E3 Cfreq
NetARD1_31: ESC3.20(DigIO3) ; port E3 Ready
NetARD1_32: ESC3.21(DigIN2) ; port E3 Dir
NetARD1_33: ESC3.22(DigIN1) ; port E3 En
NetARD1_70: ESC3.25(AnOUT_1) ; port E3 CurFB
NetARD1_71: ESC3.24(AnOUT_2) ; port E3 SpdFB
NetC17_1: C17.1 D3.2(K) ESC3.7(+Vcc) ESC3.8(+Vcc) F3.2
NetC19_1: C19.1 R12.2
NetC22_1: C22.1 R13.2
NetC24_1: C24.1 R14.2
NetESC3_1: ESC3.1(M1) ESC3.2(M1) L7.1
NetESC3_3: ESC3.3(M2) ESC3.4(M2) L8.1
NetESC3_5: ESC3.5(M3) ESC3.6(M3) L9.1
NetESC3_29: ESC3.29(AnIN_1+) TP13.1 U3.8(VOUT)

Not connected (* = marked no-connect by the designer): P6 1* 4* 9* 10*

### Notes on the sheet
- (near F3) 0157010.DR
- SMBJ54A-13-F

### Library data of the parts
C17 = Panasonic EEU-FC1J221S: Polarized Capacitor (Radial)
C18-C24 = Cap Semi: Capacitor (Semiconductor SIM Model); Published: 8-Jun-2000; LatestRevisionDate: 29-May-2009; LatestRevisionNote: IPC-7351 Footprint Added.; PackageReference: C1206; Publisher: Altium Limited; PackageDescription: Chip Capacitor
D3 = TVS_DIODE: TVS Diode; Published: 8-Jun-2000; LatestRevisionDate: 17-Jul-2002; LatestRevisionNote: Re-released for DXP Platform.; PackageVersion: Sep-1996; PackageReference: SMC; Publisher: Altium Limited; PackageDescription: DO-214-AB/SMC; 2 C-Bend Leads; Body 7.9 x 5.9 mm, inc. leads (LxW); Code_JEDEC: DO-214-AB
ESC3 = ESCON 50/8 HE: ESCON Module 50/8 HE Servocontroller
F3 = Fuse 2: Fuse; Published: 8-Jun-2000; LatestRevisionDate: 17-Jul-2002; LatestRevisionNote: Re-released for DXP Platform.; PackageReference: PIN-W2/E2.8; Publisher: Altium Limited; PackageDescription: Thru-Hole; 2 Leads
L7-L9 = DR127-4R7-R: as L1 on sheet SCH-3-ESC1; Published: 8-Jun-2000; LatestRevisionDate: 29-May-2009; LatestRevisionNote: IPC-7351 Footprint Added.; PackageReference: 0402-A; Publisher: Altium Limited; PackageDescription: Chip Inductor; Code_JEITA: 0402
P5 = Molex Mini-Fit Jr 8pos Vert: Mini-Fit Jr, 8 pos 2 row
P6 = Header_10_Pos_Ribbon Male: IDC, 10 pos, Male
R11-R14 = Res1: Resistor; Published: 8-Jun-2000; LatestRevisionDate: 17-Jul-2002; LatestRevisionNote: Re-released for DXP Platform.; PackageReference: AXIAL-0.3; Publisher: Altium Limited; PackageDescription: Axial Device, Thru-Hole; 2 Leads; 0.3 in Pin Spacing
U3 = DAC121C085: as U1 on sheet SCH-3-ESC1; ComponentLink3URL: http://www.national.com/packaging/folders/mua08a.html; ComponentLink2URL: http://www.national.com/pf/DA/DAC121C085.html; Code_JEDEC: MO-187-AA; ComponentLink1URL: http://www.national.com/ds/DA/DAC121C085.pdf; RoHS: Y; PackageVersion: revF, Apr-2008; PackageDescription: MINI SOIC, .118 x .118 x .034in, 8 Lead, .0256in Pitch; PackageReference: MUA08A; PinCount: 8; DatasheetVersion: Mar-2008; ComponentLink1Description: DAC121C085 Datasheet; ComponentLink2Description: DAC121C085 Web Page; ComponentLink3Description: MUA08A Package Page; RevisionNote: Component URLs added

## Sheet SCH-6-ESC4.SchDoc
size Letter
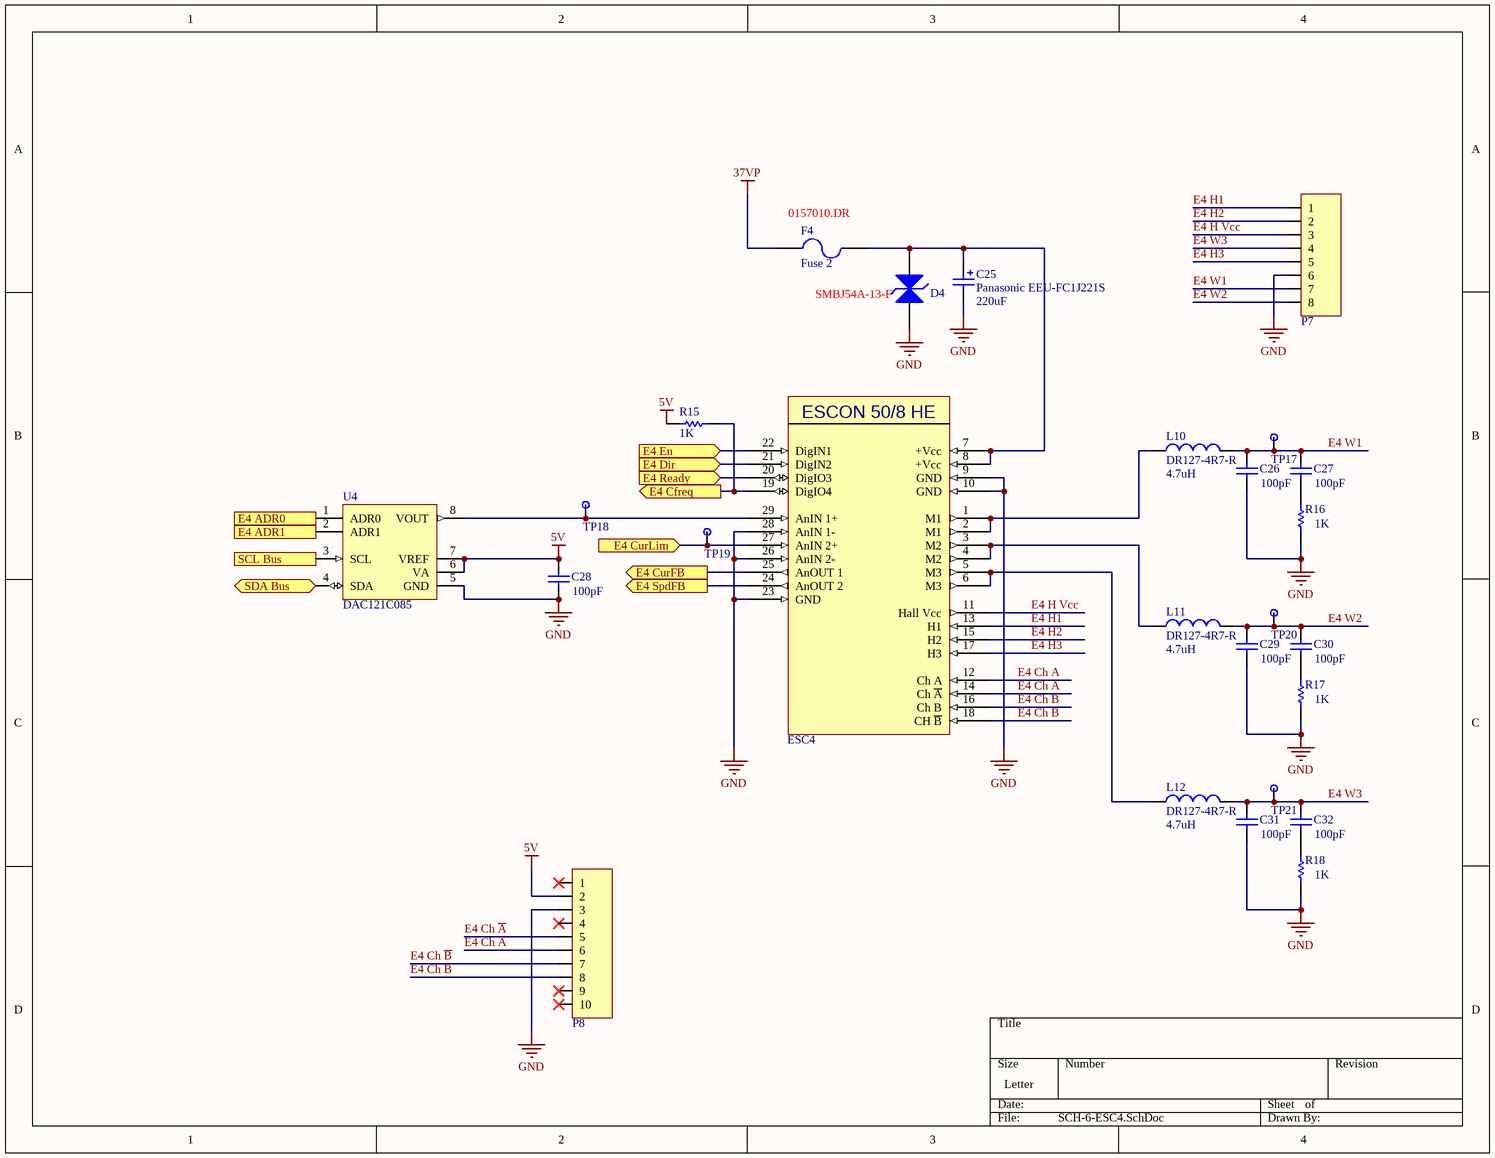
[diagram p5: SCH-6-ESC4.SchDoc]

### Parts
C25  Panasonic EEU-FC1J221S  value 220uF  [Panasonic EEU-FC1J221S]
C26  value 100pF  [C1206]  (hidden comment: Cap Semi)
C27  value 100pF  [C1206]  (hidden comment: Cap Semi)
C28  value 100pF  [C1206]  (hidden comment: Cap Semi)
C29  value 100pF  [C1206]  (hidden comment: Cap Semi)
C30  value 100pF  [C1206]  (hidden comment: Cap Semi)
C31  value 100pF  [C1206]  (hidden comment: Cap Semi)
C32  value 100pF  [C1206]  (hidden comment: Cap Semi)
D4  TVS_DIODE  [SMBJ54A-13-F]  (value not drawn)
ESC4  ESCON 50/8 HE  [ESCON 50/8 HE]  (value not drawn)
F4  Fuse 2  [0157010.DR]
L10  DR127-4R7-R  value 4.7uH  [DR127-4R7-R]
L11  DR127-4R7-R  value 4.7uH  [DR127-4R7-R]
L12  DR127-4R7-R  value 4.7uH  [DR127-4R7-R]
P7  0039281083  [Molex Mini-Fit Jr 0039281083]  (value not drawn)
P8  Header_10_Pos_Ribbon Male  [3M_2510-6002UB]  (value not drawn)
R15  value 1K  [RESC1608X06N_0603]  (hidden comment: Res1)
R16  value 1K  [RESC1608X06N_0603]  (hidden comment: Res1)
R17  value 1K  [RESC1608X06N_0603]  (hidden comment: Res1)
R18  value 1K  [RESC1608X06N_0603]  (hidden comment: Res1)
TP17  TestPt  [50_MIL_PAD]  (value not drawn)
TP18  TestPt  [50_MIL_PAD]  (value not drawn)
TP19  TestPt  [50_MIL_PAD]  (value not drawn)
TP20  TestPt  [50_MIL_PAD]  (value not drawn)
TP21  TestPt  [50_MIL_PAD]  (value not drawn)
U4  DAC121C085  [MUA08A_L]

### Ports
E4 ADR0 (in), E4 ADR1 (in), E4 Cfreq (out), E4 CurFB (out), E4 CurLim (in), E4 Dir (in), E4 En (in), E4 Ready (in), E4 SpdFB (out), SCL Bus (in), SDA Bus (bidir)

### Nets
5V: C28.2 P8.2 R15.2 U4.6(VA) U4.7(VREF)
37VP: F4.1
GND: C25.2 C26.1 C28.1 C29.1 C31.1 D4.1(A) ESC4.9(GND) ESC4.10(GND) ESC4.23(GND) ESC4.26(AnIN_2-) ESC4.28(AnIN_1-) P7.6 P8.3 R16.1 R17.1 R18.1 U4.5(GND)
E4 Ch A: ESC4.12(Ch_A) P8.6
E4 Ch ~{A}: ESC4.14(Ch_~{A}) P8.5
E4 Ch B: ESC4.16(Ch_B) P8.8
E4 Ch ~{B}: ESC4.18(CH_~{B}) P8.7
E4 H1: ESC4.13(H1) P7.1
E4 H2: ESC4.15(H2) P7.2
E4 H3: ESC4.17(H3) P7.5
E4 H Vcc: ESC4.11(Hall_Vcc) P7.3
E4 W1: C26.2 C27.2 L10.2 P7.7 TP17.1
E4 W2: C29.2 C30.2 L11.2 P7.8 TP20.1
E4 W3: C31.2 C32.2 L12.2 P7.4 TP21.1
NetARD1_6: U4.2(ADR1) ; port E4 ADR1
NetARD1_7: U4.1(ADR0) ; port E4 ADR0
NetARD1_15: ESC4.27(AnIN_2+) TP19.1 ; port E4 CurLim
NetARD1_20: U4.3(SCL) U4.4(SDA) ; port SCL Bus, port SDA Bus
NetARD1_34: ESC4.21(DigIN2) ; port E4 Dir
NetARD1_35: ESC4.22(DigIN1) ; port E4 En
NetARD1_36: ESC4.19(DigIO4) R15.1 ; port E4 Cfreq
NetARD1_37: ESC4.20(DigIO3) ; port E4 Ready
NetARD1_64: ESC4.24(AnOUT_2) ; port E4 SpdFB
NetARD1_65: ESC4.25(AnOUT_1) ; port E4 CurFB
NetC25_1: C25.1 D4.2(K) ESC4.7(+Vcc) ESC4.8(+Vcc) F4.2
NetC27_1: C27.1 R16.2
NetC30_1: C30.1 R17.2
NetC32_1: C32.1 R18.2
NetESC4_1: ESC4.1(M1) ESC4.2(M1) L10.1
NetESC4_3: ESC4.3(M2) ESC4.4(M2) L11.1
NetESC4_5: ESC4.5(M3) ESC4.6(M3) L12.1
NetESC4_29: ESC4.29(AnIN_1+) TP18.1 U4.8(VOUT)

Not connected (* = marked no-connect by the designer): P8 1* 4* 9* 10*

### Notes on the sheet
- (near F4) 0157010.DR
- (near D4) SMBJ54A-13-F

### Library data of the parts
C25 = Panasonic EEU-FC1J221S: Polarized Capacitor (Radial)
C26-C32 = Cap Semi: Capacitor (Semiconductor SIM Model); Published: 8-Jun-2000; LatestRevisionDate: 29-May-2009; LatestRevisionNote: IPC-7351 Footprint Added.; PackageReference: C1206; Publisher: Altium Limited; PackageDescription: Chip Capacitor
D4 = TVS_DIODE: TVS Diode; Published: 8-Jun-2000; LatestRevisionDate: 17-Jul-2002; LatestRevisionNote: Re-released for DXP Platform.; PackageVersion: Sep-1996; PackageReference: SMC; Publisher: Altium Limited; PackageDescription: DO-214-AB/SMC; 2 C-Bend Leads; Body 7.9 x 5.9 mm, inc. leads (LxW); Code_JEDEC: DO-214-AB
ESC4 = ESCON 50/8 HE: ESCON Module 50/8 HE Servocontroller
F4 = Fuse 2: Fuse; Published: 8-Jun-2000; LatestRevisionDate: 17-Jul-2002; LatestRevisionNote: Re-released for DXP Platform.; PackageReference: PIN-W2/E2.8; Publisher: Altium Limited; PackageDescription: Thru-Hole; 2 Leads
L10-L12 = DR127-4R7-R: as L1 on sheet SCH-3-ESC1; Published: 8-Jun-2000; LatestRevisionDate: 29-May-2009; LatestRevisionNote: IPC-7351 Footprint Added.; PackageReference: 0402-A; Publisher: Altium Limited; PackageDescription: Chip Inductor; Code_JEITA: 0402
P7 = Molex Mini-Fit Jr 8pos Vert: Mini-Fit Jr, 8 pos 2 row
P8 = Header_10_Pos_Ribbon Male: IDC, 10 pos, Male
R15-R18 = Res1: Resistor; Published: 8-Jun-2000; LatestRevisionDate: 17-Jul-2002; LatestRevisionNote: Re-released for DXP Platform.; PackageReference: AXIAL-0.3; Publisher: Altium Limited; PackageDescription: Axial Device, Thru-Hole; 2 Leads; 0.3 in Pin Spacing
U4 = DAC121C085: as U1 on sheet SCH-3-ESC1; ComponentLink3URL: http://www.national.com/packaging/folders/mua08a.html; ComponentLink2URL: http://www.national.com/pf/DA/DAC121C085.html; Code_JEDEC: MO-187-AA; ComponentLink1URL: http://www.national.com/ds/DA/DAC121C085.pdf; RoHS: Y; PackageVersion: revF, Apr-2008; PackageDescription: MINI SOIC, .118 x .118 x .034in, 8 Lead, .0256in Pitch; PackageReference: MUA08A; PinCount: 8; DatasheetVersion: Mar-2008; ComponentLink1Description: DAC121C085 Datasheet; ComponentLink2Description: DAC121C085 Web Page; ComponentLink3Description: MUA08A Package Page; RevisionNote: Component URLs added

## Sheet SCH-7-ESC5.SchDoc
size Letter
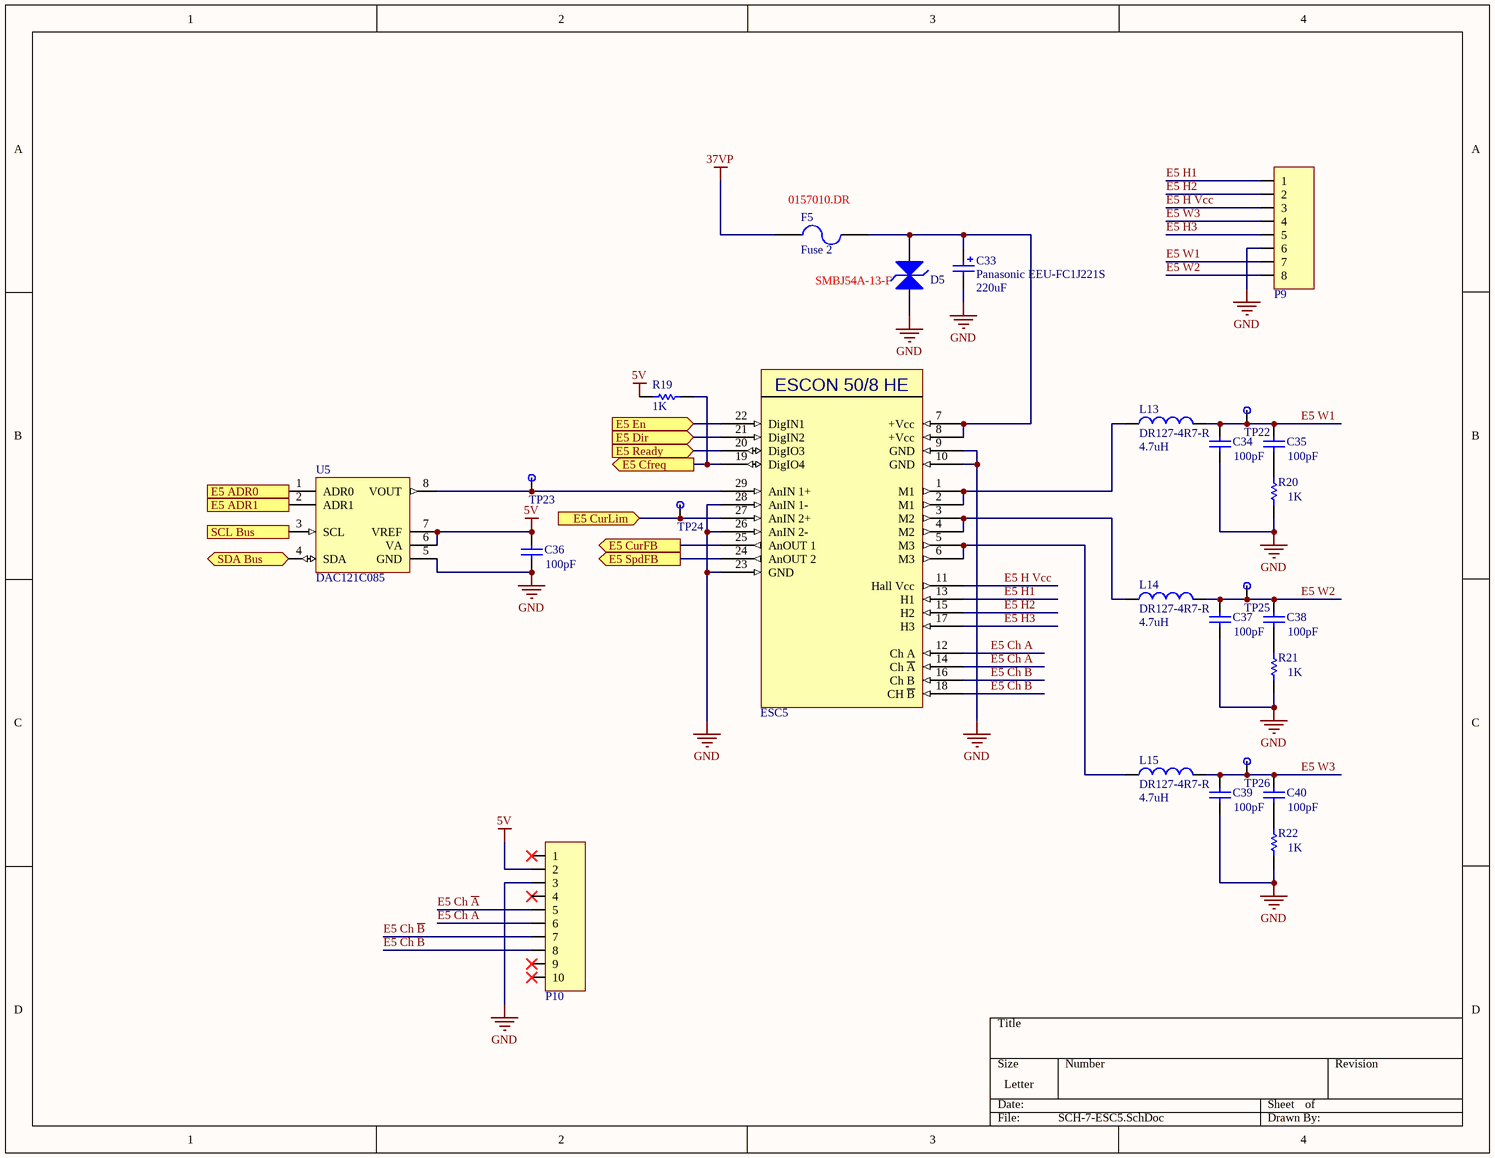
[diagram p6: SCH-7-ESC5.SchDoc]

### Parts
C33  Panasonic EEU-FC1J221S  value 220uF  [Panasonic EEU-FC1J221S]
C34  value 100pF  [C1206]  (hidden comment: Cap Semi)
C35  value 100pF  [C1206]  (hidden comment: Cap Semi)
C36  value 100pF  [C1206]  (hidden comment: Cap Semi)
C37  value 100pF  [C1206]  (hidden comment: Cap Semi)
C38  value 100pF  [C1206]  (hidden comment: Cap Semi)
C39  value 100pF  [C1206]  (hidden comment: Cap Semi)
C40  value 100pF  [C1206]  (hidden comment: Cap Semi)
D5  TVS_DIODE  [SMBJ54A-13-F]  (value not drawn)
ESC5  ESCON 50/8 HE  [ESCON 50/8 HE]  (value not drawn)
F5  Fuse 2  [0157010.DR]
L13  DR127-4R7-R  value 4.7uH  [DR127-4R7-R]
L14  DR127-4R7-R  value 4.7uH  [DR127-4R7-R]
L15  DR127-4R7-R  value 4.7uH  [DR127-4R7-R]
P9  0039281083  [Molex Mini-Fit Jr 0039281083]  (value not drawn)
P10  Header_10_Pos_Ribbon Male  [3M_2510-6002UB]  (value not drawn)
R19  value 1K  [RESC1608X06N_0603]  (hidden comment: Res1)
R20  value 1K  [RESC1608X06N_0603]  (hidden comment: Res1)
R21  value 1K  [RESC1608X06N_0603]  (hidden comment: Res1)
R22  value 1K  [RESC1608X06N_0603]  (hidden comment: Res1)
TP22  TestPt  [50_MIL_PAD]  (value not drawn)
TP23  TestPt  [50_MIL_PAD]  (value not drawn)
TP24  TestPt  [50_MIL_PAD]  (value not drawn)
TP25  TestPt  [50_MIL_PAD]  (value not drawn)
TP26  TestPt  [50_MIL_PAD]  (value not drawn)
U5  DAC121C085  [MUA08A_L]

### Ports
E5 ADR0 (in), E5 ADR1 (in), E5 Cfreq (out), E5 CurFB (out), E5 CurLim (in), E5 Dir (in), E5 En (in), E5 Ready (in), E5 SpdFB (out), SCL Bus (in), SDA Bus (bidir)

### Nets
5V: C36.2 P10.2 R19.2 U5.6(VA) U5.7(VREF)
37VP: F5.1
GND: C33.2 C34.1 C36.1 C37.1 C39.1 D5.1(A) ESC5.9(GND) ESC5.10(GND) ESC5.23(GND) ESC5.26(AnIN_2-) ESC5.28(AnIN_1-) P9.6 P10.3 R20.1 R21.1 R22.1 U5.5(GND)
E5 Ch A: ESC5.12(Ch_A) P10.6
E5 Ch ~{A}: ESC5.14(Ch_~{A}) P10.5
E5 Ch B: ESC5.16(Ch_B) P10.8
E5 Ch ~{B}: ESC5.18(CH_~{B}) P10.7
E5 H1: ESC5.13(H1) P9.1
E5 H2: ESC5.15(H2) P9.2
E5 H3: ESC5.17(H3) P9.5
E5 H Vcc: ESC5.11(Hall_Vcc) P9.3
E5 W1: C34.2 C35.2 L13.2 P9.7 TP22.1
E5 W2: C37.2 C38.2 L14.2 P9.8 TP25.1
E5 W3: C39.2 C40.2 L15.2 P9.4 TP26.1
NetARD1_4: U5.2(ADR1) ; port E5 ADR1
NetARD1_5: U5.1(ADR0) ; port E5 ADR0
NetARD1_16: ESC5.27(AnIN_2+) TP24.1 ; port E5 CurLim
NetARD1_20: U5.3(SCL) U5.4(SDA) ; port SCL Bus, port SDA Bus
NetARD1_38: ESC5.21(DigIN2) ; port E5 Dir
NetARD1_39: ESC5.22(DigIN1) ; port E5 En
NetARD1_40: ESC5.19(DigIO4) R19.1 ; port E5 Cfreq
NetARD1_41: ESC5.20(DigIO3) ; port E5 Ready
NetARD1_62: ESC5.24(AnOUT_2) ; port E5 SpdFB
NetARD1_63: ESC5.25(AnOUT_1) ; port E5 CurFB
NetC33_1: C33.1 D5.2(K) ESC5.7(+Vcc) ESC5.8(+Vcc) F5.2
NetC35_1: C35.1 R20.2
NetC38_1: C38.1 R21.2
NetC40_1: C40.1 R22.2
NetESC5_1: ESC5.1(M1) ESC5.2(M1) L13.1
NetESC5_3: ESC5.3(M2) ESC5.4(M2) L14.1
NetESC5_5: ESC5.5(M3) ESC5.6(M3) L15.1
NetESC5_29: ESC5.29(AnIN_1+) TP23.1 U5.8(VOUT)

Not connected (* = marked no-connect by the designer): P10 1* 4* 9* 10*

### Notes on the sheet
- (near F5) 0157010.DR
- (near D5) SMBJ54A-13-F

### Library data of the parts
C33 = Panasonic EEU-FC1J221S: Polarized Capacitor (Radial)
C34-C40 = Cap Semi: Capacitor (Semiconductor SIM Model); Published: 8-Jun-2000; LatestRevisionDate: 29-May-2009; LatestRevisionNote: IPC-7351 Footprint Added.; PackageReference: C1206; Publisher: Altium Limited; PackageDescription: Chip Capacitor
D5 = TVS_DIODE: TVS Diode; Published: 8-Jun-2000; LatestRevisionDate: 17-Jul-2002; LatestRevisionNote: Re-released for DXP Platform.; PackageVersion: Sep-1996; PackageReference: SMC; Publisher: Altium Limited; PackageDescription: DO-214-AB/SMC; 2 C-Bend Leads; Body 7.9 x 5.9 mm, inc. leads (LxW); Code_JEDEC: DO-214-AB
ESC5 = ESCON 50/8 HE: ESCON Module 50/8 HE Servocontroller
F5 = Fuse 2: Fuse; Published: 8-Jun-2000; LatestRevisionDate: 17-Jul-2002; LatestRevisionNote: Re-released for DXP Platform.; PackageReference: PIN-W2/E2.8; Publisher: Altium Limited; PackageDescription: Thru-Hole; 2 Leads
L13-L15 = DR127-4R7-R: as L1 on sheet SCH-3-ESC1; Published: 8-Jun-2000; LatestRevisionDate: 29-May-2009; LatestRevisionNote: IPC-7351 Footprint Added.; PackageReference: 0402-A; Publisher: Altium Limited; PackageDescription: Chip Inductor; Code_JEITA: 0402
P9 = Molex Mini-Fit Jr 8pos Vert: Mini-Fit Jr, 8 pos 2 row
P10 = Header_10_Pos_Ribbon Male: IDC, 10 pos, Male
R19-R22 = Res1: Resistor; Published: 8-Jun-2000; LatestRevisionDate: 17-Jul-2002; LatestRevisionNote: Re-released for DXP Platform.; PackageReference: AXIAL-0.3; Publisher: Altium Limited; PackageDescription: Axial Device, Thru-Hole; 2 Leads; 0.3 in Pin Spacing
U5 = DAC121C085: as U1 on sheet SCH-3-ESC1; ComponentLink3URL: http://www.national.com/packaging/folders/mua08a.html; ComponentLink2URL: http://www.national.com/pf/DA/DAC121C085.html; Code_JEDEC: MO-187-AA; ComponentLink1URL: http://www.national.com/ds/DA/DAC121C085.pdf; RoHS: Y; PackageVersion: revF, Apr-2008; PackageDescription: MINI SOIC, .118 x .118 x .034in, 8 Lead, .0256in Pitch; PackageReference: MUA08A; PinCount: 8; DatasheetVersion: Mar-2008; ComponentLink1Description: DAC121C085 Datasheet; ComponentLink2Description: DAC121C085 Web Page; ComponentLink3Description: MUA08A Package Page; RevisionNote: Component URLs added

## Sheet SCH-8-ESC6.SchDoc
size Letter
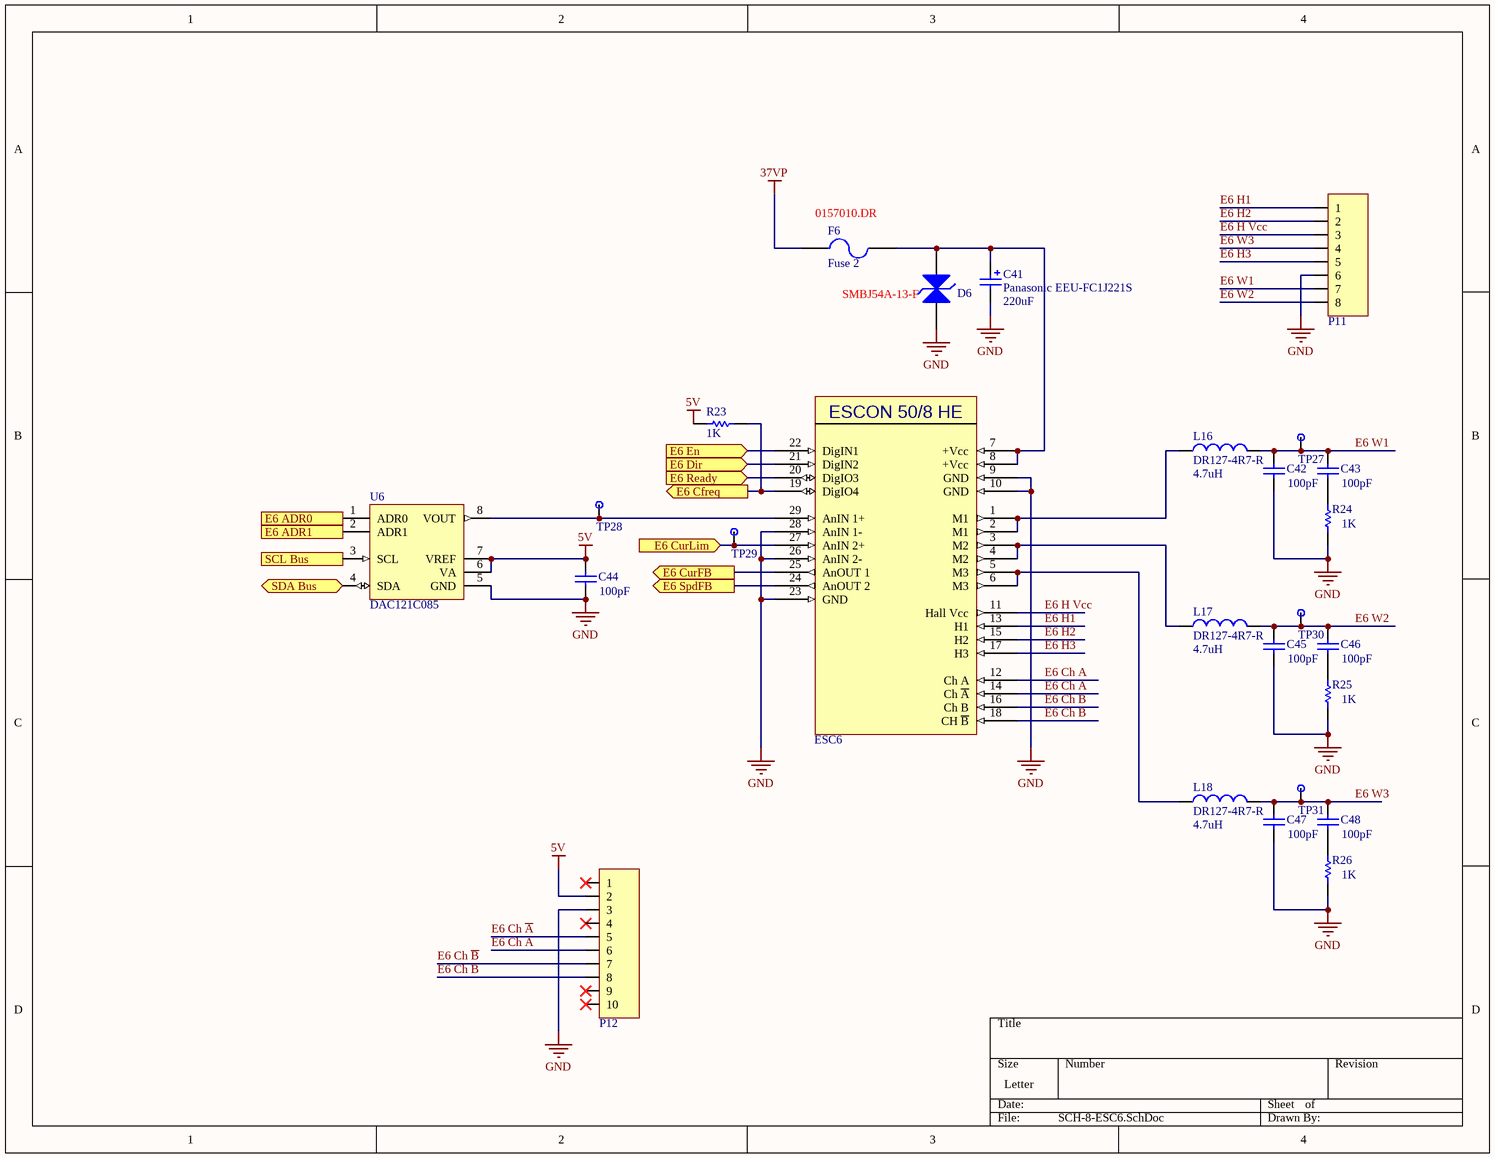
[diagram p7: SCH-8-ESC6.SchDoc]

### Parts
C41  Panasonic EEU-FC1J221S  value 220uF  [Panasonic EEU-FC1J221S]
C42  value 100pF  [C1206]  (hidden comment: Cap Semi)
C43  value 100pF  [C1206]  (hidden comment: Cap Semi)
C44  value 100pF  [C1206]  (hidden comment: Cap Semi)
C45  value 100pF  [C1206]  (hidden comment: Cap Semi)
C46  value 100pF  [C1206]  (hidden comment: Cap Semi)
C47  value 100pF  [C1206]  (hidden comment: Cap Semi)
C48  value 100pF  [C1206]  (hidden comment: Cap Semi)
D6  TVS_DIODE  [SMBJ54A-13-F]  (value not drawn)
ESC6  ESCON 50/8 HE  [ESCON 50/8 HE]  (value not drawn)
F6  Fuse 2  [0157010.DR]
L16  DR127-4R7-R  value 4.7uH  [DR127-4R7-R]
L17  DR127-4R7-R  value 4.7uH  [DR127-4R7-R]
L18  DR127-4R7-R  value 4.7uH  [DR127-4R7-R]
P11  0039281083  [Molex Mini-Fit Jr 0039281083]  (value not drawn)
P12  Header_10_Pos_Ribbon Male  [3M_2510-6002UB]  (value not drawn)
R23  value 1K  [RESC1608X06N_0603]  (hidden comment: Res1)
R24  value 1K  [RESC1608X06N_0603]  (hidden comment: Res1)
R25  value 1K  [RESC1608X06N_0603]  (hidden comment: Res1)
R26  value 1K  [RESC1608X06N_0603]  (hidden comment: Res1)
TP27  TestPt  [50_MIL_PAD]  (value not drawn)
TP28  TestPt  [50_MIL_PAD]  (value not drawn)
TP29  TestPt  [50_MIL_PAD]  (value not drawn)
TP30  TestPt  [50_MIL_PAD]  (value not drawn)
TP31  TestPt  [50_MIL_PAD]  (value not drawn)
U6  DAC121C085  [MUA08A_L]

### Ports
E6 ADR0 (in), E6 ADR1 (in), E6 Cfreq (out), E6 CurFB (out), E6 CurLim (in), E6 Dir (in), E6 En (in), E6 Ready (in), E6 SpdFB (out), SCL Bus (in), SDA Bus (bidir)

### Nets
5V: C44.2 P12.2 R23.2 U6.6(VA) U6.7(VREF)
37VP: F6.1
GND: C41.2 C42.1 C44.1 C45.1 C47.1 D6.1(A) ESC6.9(GND) ESC6.10(GND) ESC6.23(GND) ESC6.26(AnIN_2-) ESC6.28(AnIN_1-) P11.6 P12.3 R24.1 R25.1 R26.1 U6.5(GND)
E6 Ch A: ESC6.12(Ch_A) P12.6
E6 Ch ~{A}: ESC6.14(Ch_~{A}) P12.5
E6 Ch B: ESC6.16(Ch_B) P12.8
E6 Ch ~{B}: ESC6.18(CH_~{B}) P12.7
E6 H1: ESC6.13(H1) P11.1
E6 H2: ESC6.15(H2) P11.2
E6 H3: ESC6.17(H3) P11.5
E6 H Vcc: ESC6.11(Hall_Vcc) P11.3
E6 W1: C42.2 C43.2 L16.2 P11.7 TP27.1
E6 W2: C45.2 C46.2 L17.2 P11.8 TP30.1
E6 W3: C47.2 C48.2 L18.2 P11.4 TP31.1
NetARD1_2: U6.2(ADR1) ; port E6 ADR1
NetARD1_3: U6.1(ADR0) ; port E6 ADR0
NetARD1_17: ESC6.27(AnIN_2+) TP29.1 ; port E6 CurLim
NetARD1_20: U6.3(SCL) U6.4(SDA) ; port SCL Bus, port SDA Bus
NetARD1_42: ESC6.19(DigIO4) R23.1 ; port E6 Cfreq
NetARD1_43: ESC6.20(DigIO3) ; port E6 Ready
NetARD1_44: ESC6.21(DigIN2) ; port E6 Dir
NetARD1_45: ESC6.22(DigIN1) ; port E6 En
NetARD1_60: ESC6.24(AnOUT_2) ; port E6 SpdFB
NetARD1_61: ESC6.25(AnOUT_1) ; port E6 CurFB
NetC41_1: C41.1 D6.2(K) ESC6.7(+Vcc) ESC6.8(+Vcc) F6.2
NetC43_1: C43.1 R24.2
NetC46_1: C46.1 R25.2
NetC48_1: C48.1 R26.2
NetESC6_1: ESC6.1(M1) ESC6.2(M1) L16.1
NetESC6_3: ESC6.3(M2) ESC6.4(M2) L17.1
NetESC6_5: ESC6.5(M3) ESC6.6(M3) L18.1
NetESC6_29: ESC6.29(AnIN_1+) TP28.1 U6.8(VOUT)

Not connected (* = marked no-connect by the designer): P12 1* 4* 9* 10*

### Notes on the sheet
- (near F6) 0157010.DR
- (near D6) SMBJ54A-13-F

### Library data of the parts
C41 = Panasonic EEU-FC1J221S: Polarized Capacitor (Radial)
C42-C48 = Cap Semi: Capacitor (Semiconductor SIM Model); Published: 8-Jun-2000; LatestRevisionDate: 29-May-2009; LatestRevisionNote: IPC-7351 Footprint Added.; PackageReference: C1206; Publisher: Altium Limited; PackageDescription: Chip Capacitor
D6 = TVS_DIODE: TVS Diode; Published: 8-Jun-2000; LatestRevisionDate: 17-Jul-2002; LatestRevisionNote: Re-released for DXP Platform.; PackageVersion: Sep-1996; PackageReference: SMC; Publisher: Altium Limited; PackageDescription: DO-214-AB/SMC; 2 C-Bend Leads; Body 7.9 x 5.9 mm, inc. leads (LxW); Code_JEDEC: DO-214-AB
ESC6 = ESCON 50/8 HE: ESCON Module 50/8 HE Servocontroller
F6 = Fuse 2: Fuse; Published: 8-Jun-2000; LatestRevisionDate: 17-Jul-2002; LatestRevisionNote: Re-released for DXP Platform.; PackageReference: PIN-W2/E2.8; Publisher: Altium Limited; PackageDescription: Thru-Hole; 2 Leads
L16-L18 = DR127-4R7-R: as L1 on sheet SCH-3-ESC1; Published: 8-Jun-2000; LatestRevisionDate: 29-May-2009; LatestRevisionNote: IPC-7351 Footprint Added.; PackageReference: 0402-A; Publisher: Altium Limited; PackageDescription: Chip Inductor; Code_JEITA: 0402
P11 = Molex Mini-Fit Jr 8pos Vert: Mini-Fit Jr, 8 pos 2 row
P12 = Header_10_Pos_Ribbon Male: IDC, 10 pos, Male
R23-R26 = Res1: Resistor; Published: 8-Jun-2000; LatestRevisionDate: 17-Jul-2002; LatestRevisionNote: Re-released for DXP Platform.; PackageReference: AXIAL-0.3; Publisher: Altium Limited; PackageDescription: Axial Device, Thru-Hole; 2 Leads; 0.3 in Pin Spacing
U6 = DAC121C085: as U1 on sheet SCH-3-ESC1; ComponentLink3URL: http://www.national.com/packaging/folders/mua08a.html; ComponentLink2URL: http://www.national.com/pf/DA/DAC121C085.html; Code_JEDEC: MO-187-AA; ComponentLink1URL: http://www.national.com/ds/DA/DAC121C085.pdf; RoHS: Y; PackageVersion: revF, Apr-2008; PackageDescription: MINI SOIC, .118 x .118 x .034in, 8 Lead, .0256in Pitch; PackageReference: MUA08A; PinCount: 8; DatasheetVersion: Mar-2008; ComponentLink1Description: DAC121C085 Datasheet; ComponentLink2Description: DAC121C085 Web Page; ComponentLink3Description: MUA08A Package Page; RevisionNote: Component URLs added

## Sheet SCH-9-Battery Voltage Indicators.SchDoc
size B
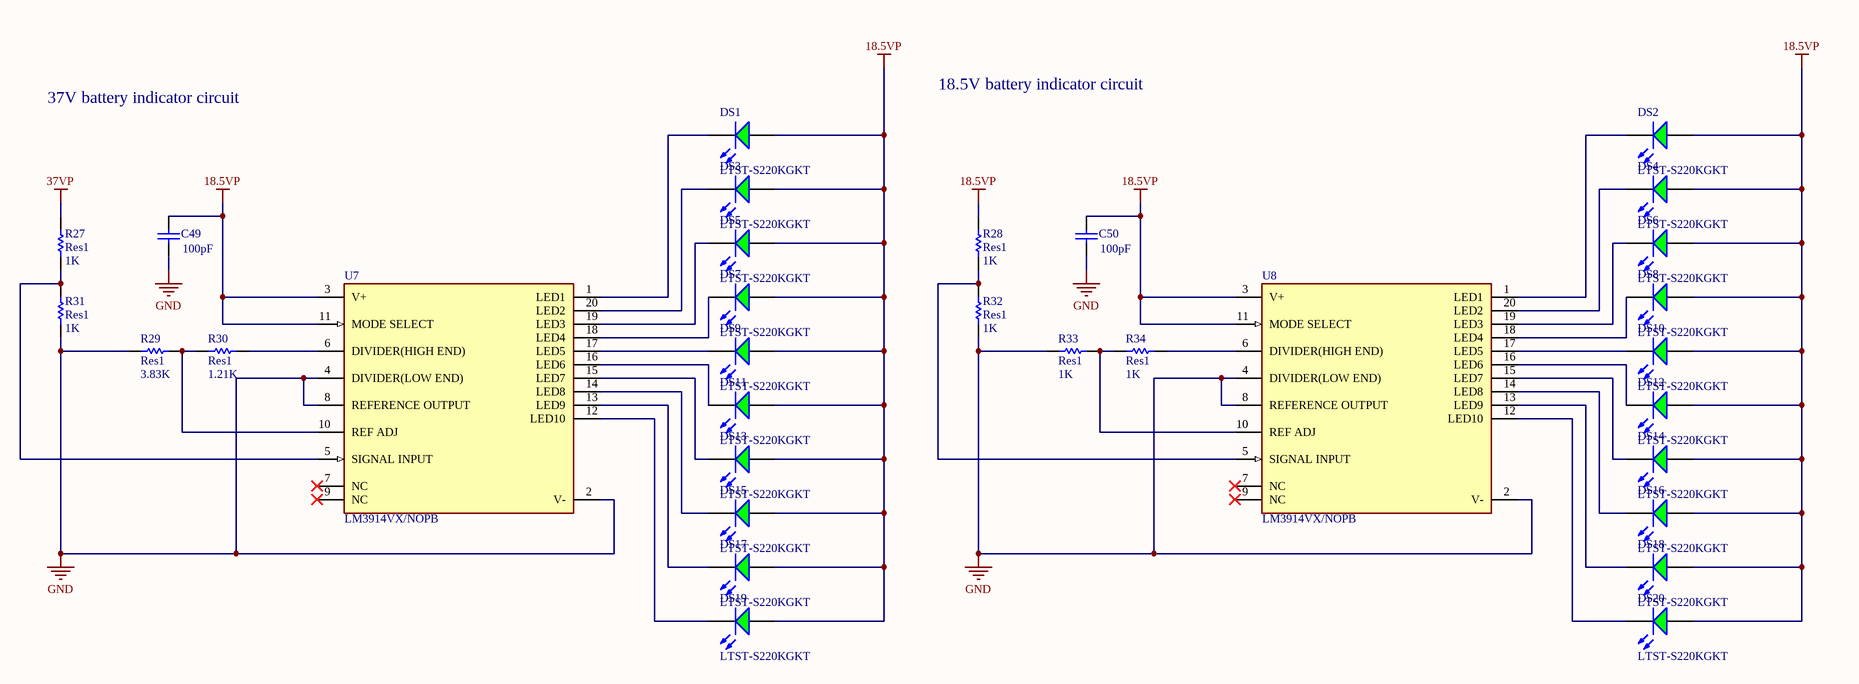
[diagram p8: SCH-9-Battery Voltage Indicators.SchDoc]

### Parts
C49  value 100pF  [C1206]  (hidden comment: Cap Semi)
C50  value 100pF  [C1206]  (hidden comment: Cap Semi)
DS1  LTST-S220KGKT  [LTST-S220KGKT_V]
DS2  LTST-S220KGKT  [LTST-S220KGKT_V]
DS3  LTST-S220KGKT  [LTST-S220KGKT_V]
DS4  LTST-S220KGKT  [LTST-S220KGKT_V]
DS5  LTST-S220KGKT  [LTST-S220KGKT_V]
DS6  LTST-S220KGKT  [LTST-S220KGKT_V]
DS7  LTST-S220KGKT  [LTST-S220KGKT_V]
DS8  LTST-S220KGKT  [LTST-S220KGKT_V]
DS9  LTST-S220KGKT  [LTST-S220KGKT_V]
DS10  LTST-S220KGKT  [LTST-S220KGKT_V]
DS11  LTST-S220KGKT  [LTST-S220KGKT_V]
DS12  LTST-S220KGKT  [LTST-S220KGKT_V]
DS13  LTST-S220KGKT  [LTST-S220KGKT_V]
DS14  LTST-S220KGKT  [LTST-S220KGKT_V]
DS15  LTST-S220KGKT  [LTST-S220KGKT_V]
DS16  LTST-S220KGKT  [LTST-S220KGKT_V]
DS17  LTST-S220KGKT  [LTST-S220KGKT_V]
DS18  LTST-S220KGKT  [LTST-S220KGKT_V]
DS19  LTST-S220KGKT  [LTST-S220KGKT_V]
DS20  LTST-S220KGKT  [LTST-S220KGKT_V]
R27  Res1  value 1K  [RESC1608X06N_0603]
R28  Res1  value 1K  [RESC1608X06N_0603]
R29  Res1  value 3.83K  [RESC1608X06N_0603]
R30  Res1  value 1.21K  [RESC1608X06N_0603]
R31  Res1  value 1K  [RESC1608X06N_0603]
R32  Res1  value 1K  [RESC1608X06N_0603]
R33  Res1  value 1K  [RESC1608X06N_0603]
R34  Res1  value 1K  [RESC1608X06N_0603]
U7  LM3914VX/NOPB  [FP-FN0020A-MFG]
U8  LM3914VX/NOPB  [FP-FN0020A-MFG]

### Nets
18.5VP: C49.2 C50.2 DS1.1(A) DS2.1(A) DS3.1(A) DS4.1(A) DS5.1(A) DS6.1(A) DS7.1(A) DS8.1(A) DS9.1(A) DS10.1(A) DS11.1(A) DS12.1(A) DS13.1(A) DS14.1(A) DS15.1(A) DS16.1(A) DS17.1(A) DS18.1(A) DS19.1(A) DS20.1(A) R28.2 U7.3(V+) U7.11(MODE_SELECT) U8.3(V+) U8.11(MODE_SELECT)
37VP: R27.2
GND: C49.1 C50.1 R29.1 R31.1 R32.1 R33.1 U7.2(V-) U7.4(DIVIDER(LOW_END)) U7.8(REFERENCE_OUTPUT) U8.2(V-) U8.4(DIVIDER(LOW_END)) U8.8(REFERENCE_OUTPUT)
NetDS1_2: DS1.2(K) U7.1(LED1)
NetDS2_2: DS2.2(K) U8.1(LED1)
NetDS3_2: DS3.2(K) U7.20(LED2)
NetDS4_2: DS4.2(K) U8.20(LED2)
NetDS5_2: DS5.2(K) U7.19(LED3)
NetDS6_2: DS6.2(K) U8.19(LED3)
NetDS7_2: DS7.2(K) U7.18(LED4)
NetDS8_2: DS8.2(K) U8.18(LED4)
NetDS9_2: DS9.2(K) U7.17(LED5)
NetDS10_2: DS10.2(K) U8.17(LED5)
NetDS11_2: DS11.2(K) U7.16(LED6)
NetDS12_2: DS12.2(K) U8.16(LED6)
NetDS13_2: DS13.2(K) U7.15(LED7)
NetDS14_2: DS14.2(K) U8.15(LED7)
NetDS15_2: DS15.2(K) U7.14(LED8)
NetDS16_2: DS16.2(K) U8.14(LED8)
NetDS17_2: DS17.2(K) U7.13(LED9)
NetDS18_2: DS18.2(K) U8.13(LED9)
NetDS19_2: DS19.2(K) U7.12(LED10)
NetDS20_2: DS20.2(K) U8.12(LED10)
NetR27_1: R27.1 R31.2 U7.5(SIGNAL_INPUT)
NetR28_1: R28.1 R32.2 U8.5(SIGNAL_INPUT)
NetR29_2: R29.2 R30.1 U7.10(REF_ADJ)
NetR30_2: R30.2 U7.6(DIVIDER(HIGH_END))
NetR33_2: R33.2 R34.1 U8.10(REF_ADJ)
NetR34_2: R34.2 U8.6(DIVIDER(HIGH_END))

Not connected (* = marked no-connect by the designer): U7 7(NC)* 9(NC)*; U8 7(NC)* 9(NC)*

### Notes on the sheet
- 18.5V battery indicator circuit
- 37V battery indicator circuit

### Library data of the parts
C49 C50 = Cap Semi: Capacitor (Semiconductor SIM Model); Published: 8-Jun-2000; LatestRevisionDate: 29-May-2009; LatestRevisionNote: IPC-7351 Footprint Added.; PackageReference: C1206; Publisher: Altium Limited; PackageDescription: Chip Capacitor
DS1-DS20 = CMP-2000-06628-1: LED Green, 75 mW, 30 mA, -30 to 85 degC, 2-Pin SMD, RoHS, Tape and Reel; Manufacturer: Lite-On; Chip Material: AlGaInP; Lum Intensity: 35mcd; Rad Hardened: No; Number of  Elements: 1; Forward Current: 30mA; Power Dissipation: 75W; Reverse Voltage: 5V; High Brightness: Yes; Test Current (It): 20mA; Dominant Wave Length: 571nm; Emitting Color: YellowGreen; Product Length (mm): 2.1mm; Peak Wavelength: 574nm; Product Depth (mm): 0.6mm; Type: Uni-Color; Main Category: ChipLED; Shape Type: Rectangular; DELETED: Compliant; Forward Voltage: 2.4V; Viewing Angle: 130deg; Product Height (mm): 1mm; Package Reference: S220KGKT; Operating Temp Range: -55Cto85C; Lens Dimensions: 1.7x0.6x0.5mm; Manufacturer URL: http://www.us.liteon.com/; Luminous Intensity: 35mcd; Datasheet URL: http://optoelectronics.liteon.com/upload/download/DS22-2000-075/S_110_LTST-S220KGKT.pdf; Package Type: ChipLed; Packaging: TapeandReel; Mounting Technology: SurfaceMount; Mounting: SurfaceMount; Operating Temperature Classification: Industrial; Package Description: 2-Pin Surface Mount Device, Body 2.15 x 0.6 mm; Datasheet Version: Rev. D, 12/2013; Pin Count: 2
R27-R34 = Res1: Resistor; Published: 8-Jun-2000; LatestRevisionDate: 17-Jul-2002; LatestRevisionNote: Re-released for DXP Platform.; PackageReference: AXIAL-0.3; Publisher: Altium Limited; PackageDescription: Axial Device, Thru-Hole; 2 Leads; 0.3 in Pin Spacing
U7 U8 = CMP-04914-000012-1: IC DRVR DOT/BAR DISPLAY 20PLCC; Manufacturer: Texas Instruments; Standoff Height: 0.51mm; Min Supply Voltage: 3V; Output Current: 10mA; Number Of Outputs: 10; Description: LED DRVR 10Segment 20-Pin PLCC T/R; Output Voltage: 1.28V; Max Supply Voltage: 15V; Automotive: No; Temperature: 0°C to +70°C; Device Class L2: Power Management ICs; Ipc Land Pattern Name: PLCC127P990X990X457-20; Octopart: https://octopart.com/lm3914vx%2Fnopb-texas+instruments-24814204; Height: 4.57mm; Package: FN0020A; Mouser Description: LED Lighting Drivers DOT/BAR DISPLAY DRVR; Temperature Range Low: 0°C; Category: IC; ComponentLink2URL: http://www.ti.com/lit/ds/symlink/lm3914.pdf; Digikey Description: IC DRVR DOT/BAR DISPLAY 20PLCC; Lead Free: Yes; Device Class L1: Integrated Circuits (ICs); RoHS: TRUE; Temperature Range High: +70°C; Device Class L3: LED Drivers; Manufacturer Part Number: LM3914VX/NOPB; ComponentLink2Description: Datasheet

## Sheet SCH-10-Power Connectors.SchDoc
size A4
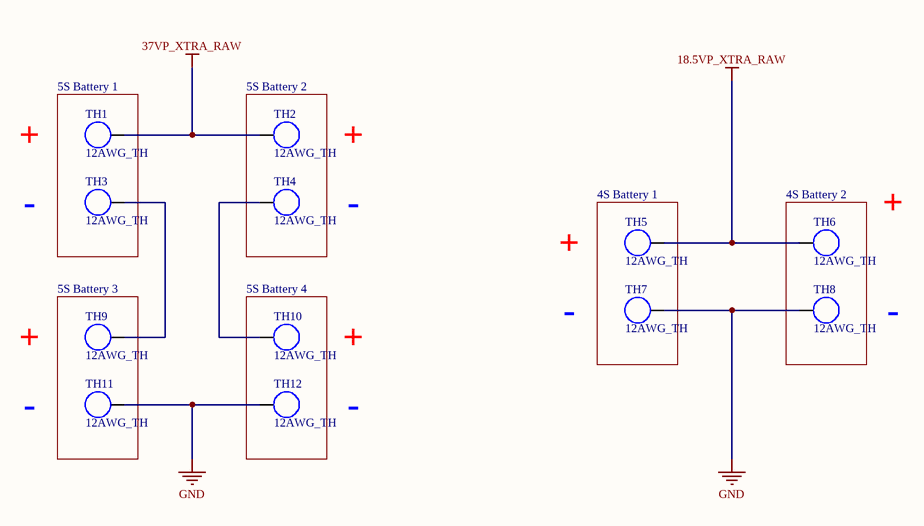
[diagram p9: SCH-10-Power Connectors.SchDoc]

### Parts
TH1  12AWG_TH  [12AWG_Wire_TH]
TH2  12AWG_TH  [12AWG_Wire_TH]
TH3  12AWG_TH  [12AWG_Wire_TH]
TH4  12AWG_TH  [12AWG_Wire_TH]
TH5  12AWG_TH  [12AWG_Wire_TH]
TH6  12AWG_TH  [12AWG_Wire_TH]
TH7  12AWG_TH  [12AWG_Wire_TH]
TH8  12AWG_TH  [12AWG_Wire_TH]
TH9  12AWG_TH  [12AWG_Wire_TH]
TH10  12AWG_TH  [12AWG_Wire_TH]
TH11  12AWG_TH  [12AWG_Wire_TH]
TH12  12AWG_TH  [12AWG_Wire_TH]

### Blocks framed on the sheet
5S Battery 1: TH1 TH3
5S Battery 2: TH2 TH4
4S Battery 1: TH5 TH7
4S Battery 2: TH6 TH8
5S Battery 3: TH9 TH11
5S Battery 4: TH10 TH12

### Nets
18.5VP_XTRA_RAW: TH5.1 TH6.1
37VP_XTRA_RAW: TH1.1 TH2.1
GND: TH7.1 TH8.1 TH11.1 TH12.1
NetTH3_1: TH3.1 TH9.1
NetTH4_1: TH4.1 TH10.1

### Notes on the sheet
- +
- -

## Sheet SCH-11-Out Going Connectors.SchDoc
size A4
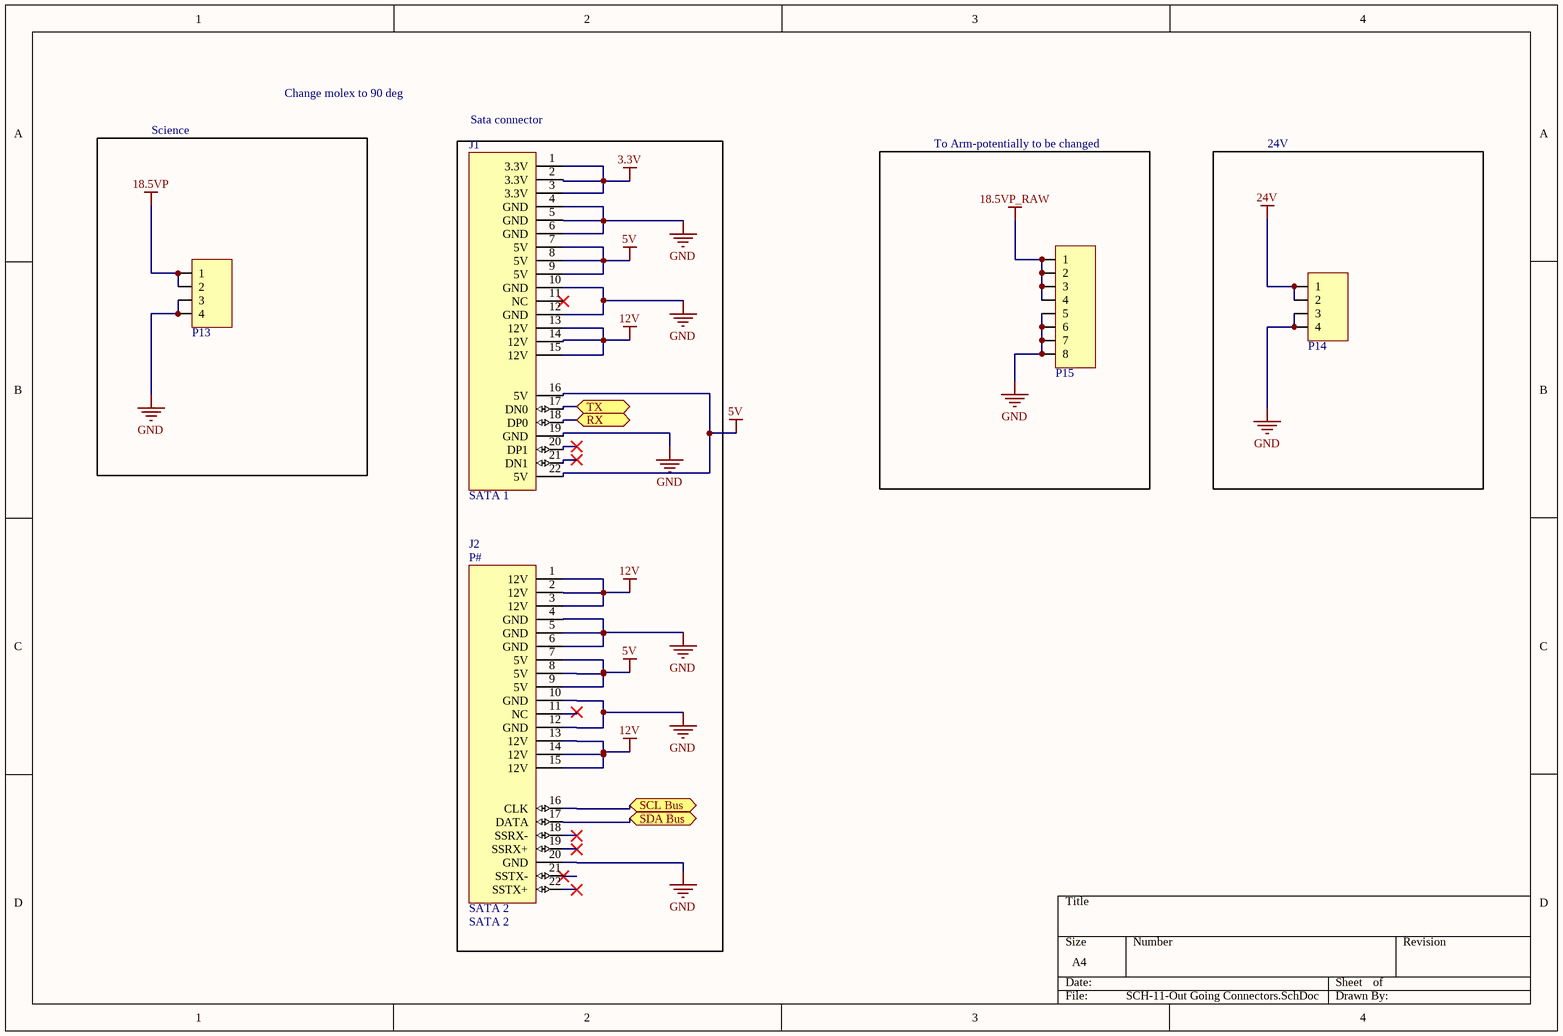
[diagram p10: SCH-11-Out Going Connectors.SchDoc]

### Parts
J1  SATA 1  [SATA Female]
J2  SATA 2  [SATA Female]
P13  Mini-Fit Jr 4 Pos  [MOLEX 0039281043]  (value not drawn)
P14  Mini-Fit Jr 4 Pos  [MOLEX 0039281043]  (value not drawn)
P15  Mini-Fit Jr 8 Pos RA  [MOLEX 172065-0208]  (value not drawn)

### Blocks framed on the sheet
Science: P13
Sata connector: J1 J2
To Arm-potentially to be changed: P15
24V: P14

### Ports
RX (bidir), SCL Bus (bidir), SDA Bus (bidir), TX (bidir)

### Nets
3.3V: J1.1(3.3V) J1.2(3.3V) J1.3(3.3V)
5V: J1.7(5V) J1.8(5V) J1.9(5V) J1.16(5V) J1.22(5V) J2.7(5V) J2.8(5V) J2.9(5V)
12V: J1.13(12V) J1.14(12V) J1.15(12V) J2.1(12V) J2.2(12V) J2.3(12V) J2.13(12V) J2.14(12V) J2.15(12V)
18.5VP: P13.1 P13.2
18.5VP_RAW: P15.1 P15.2 P15.3 P15.4
24V: P14.1 P14.2
GND: J1.4(GND) J1.5(GND) J1.6(GND) J1.10(GND) J1.12(GND) J1.19(GND) J2.4(GND) J2.5(GND) J2.6(GND) J2.10(GND) J2.12(GND) J2.20(GND) P13.3 P13.4 P14.3 P14.4 P15.5 P15.6 P15.7 P15.8
NetARD1_18: J1.17(DN0) ; port TX
NetARD1_19: J1.18(DP0) ; port RX
NetARD1_20: J2.16(CLK) J2.17(DATA) ; port SCL Bus, port SDA Bus

Not connected (* = marked no-connect by the designer): J1 11(NC)* 20(DP1)* 21(DN1)*; J2 11(NC)* 18(SSRX-)* 19(SSRX+)* 21(SSTX-)* 22(SSTX+)*

### Notes on the sheet
- Change molex to 90 deg
- (in symbol SATA 2) P#

### Library data of the parts
J1 = SATA 1: SATA connector. / Connector 1 for option 1 as per Spec; Supplier 1: Digi-Key
J2 = SATA 2: SATA connector. / Connector 2 for option 1 as per Spec; Supplier 1: Digi-Key
P13 P14 = Molex 0039281043: Mini-Fit Jr. Header, Dual Row, Right-Angle, with Snap-in Plastic Peg PCB Lock, 6 Circuits, PA Polyamide Nylon 6/6 94V-2, 0.76µm Select Gold (Au) Plating
P15 = Molex Mega-Fit 8pos Vert: Mega-Fit, 8 pos 2 row